# Altium project GameBoard_V1I1.PrjPcb (part 1 of 20)
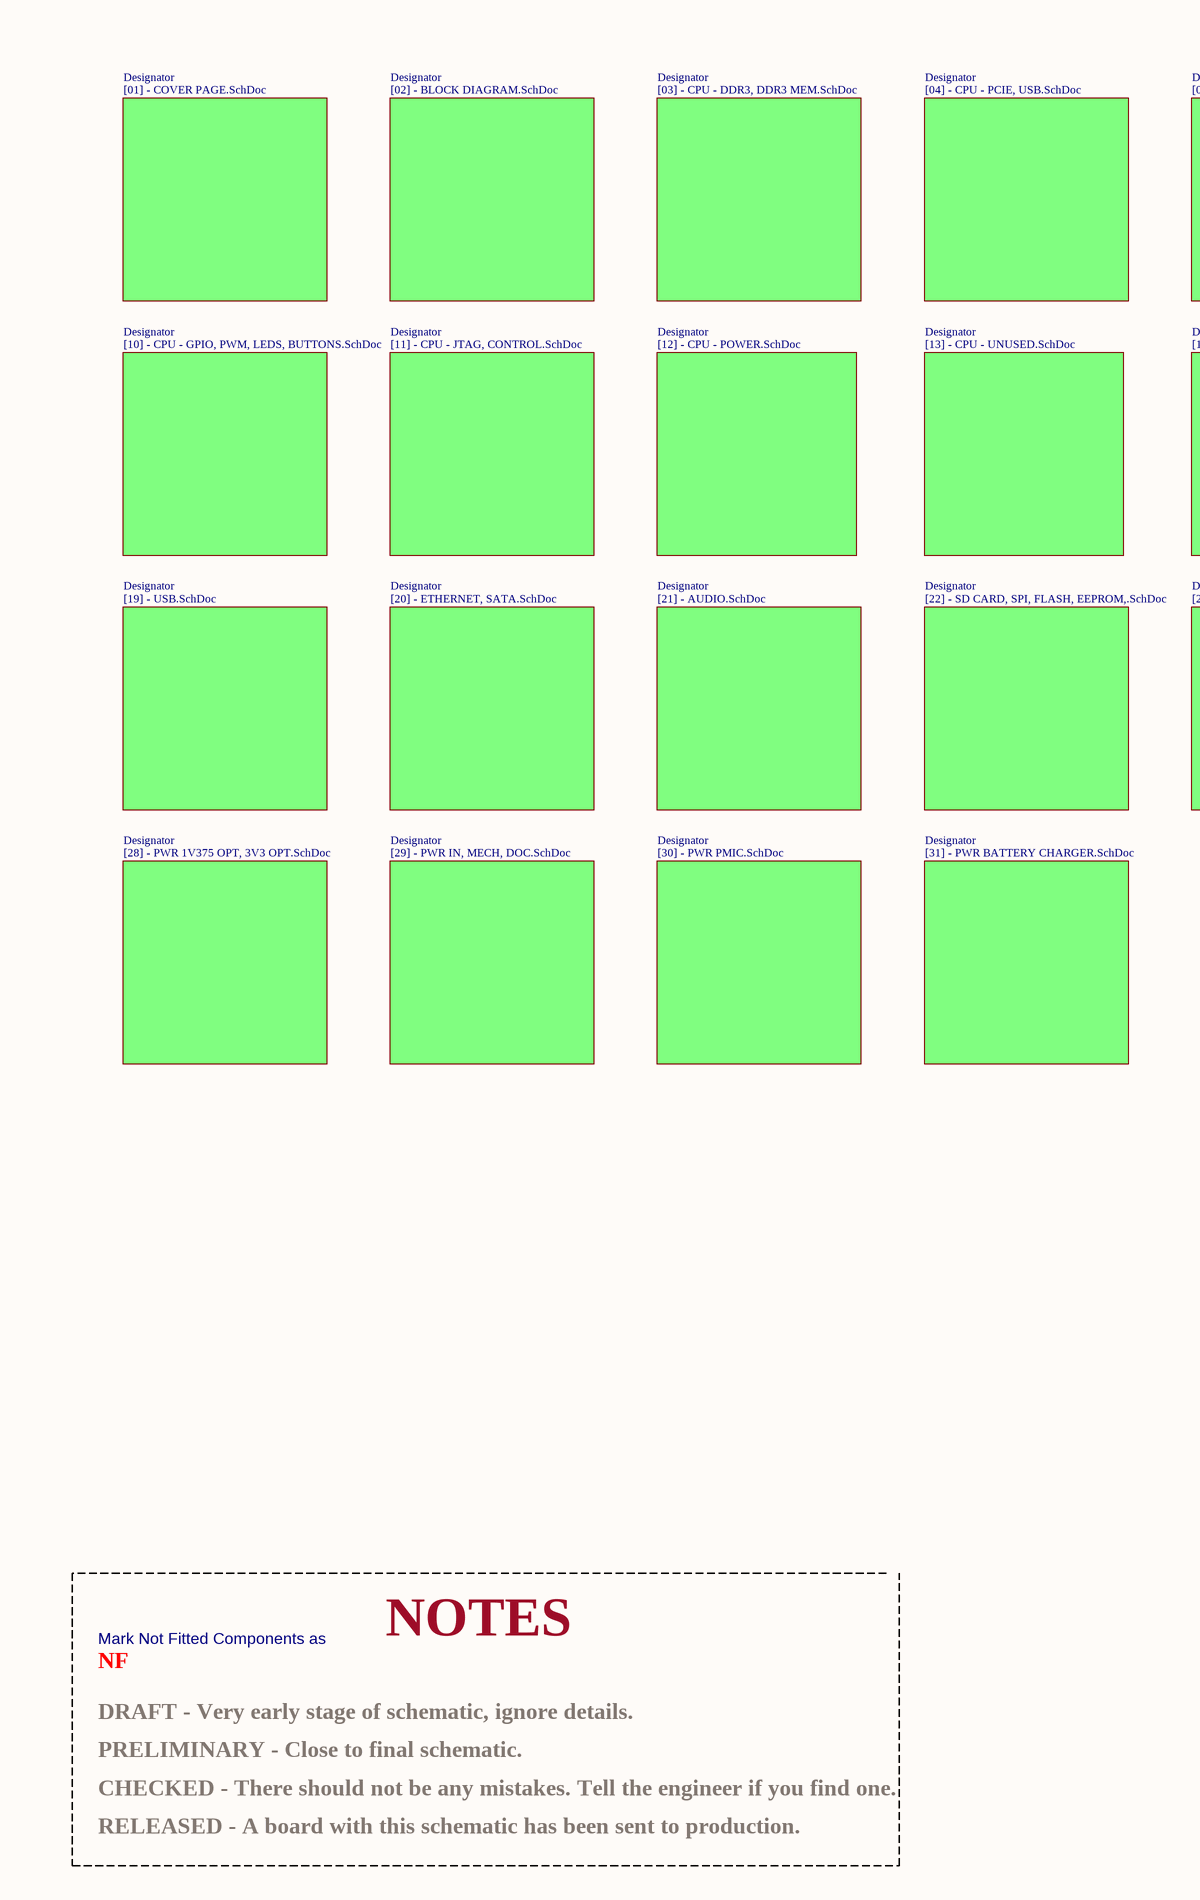
[diagram p0: GameBoard_V1I1 Project.SchDoc, left]
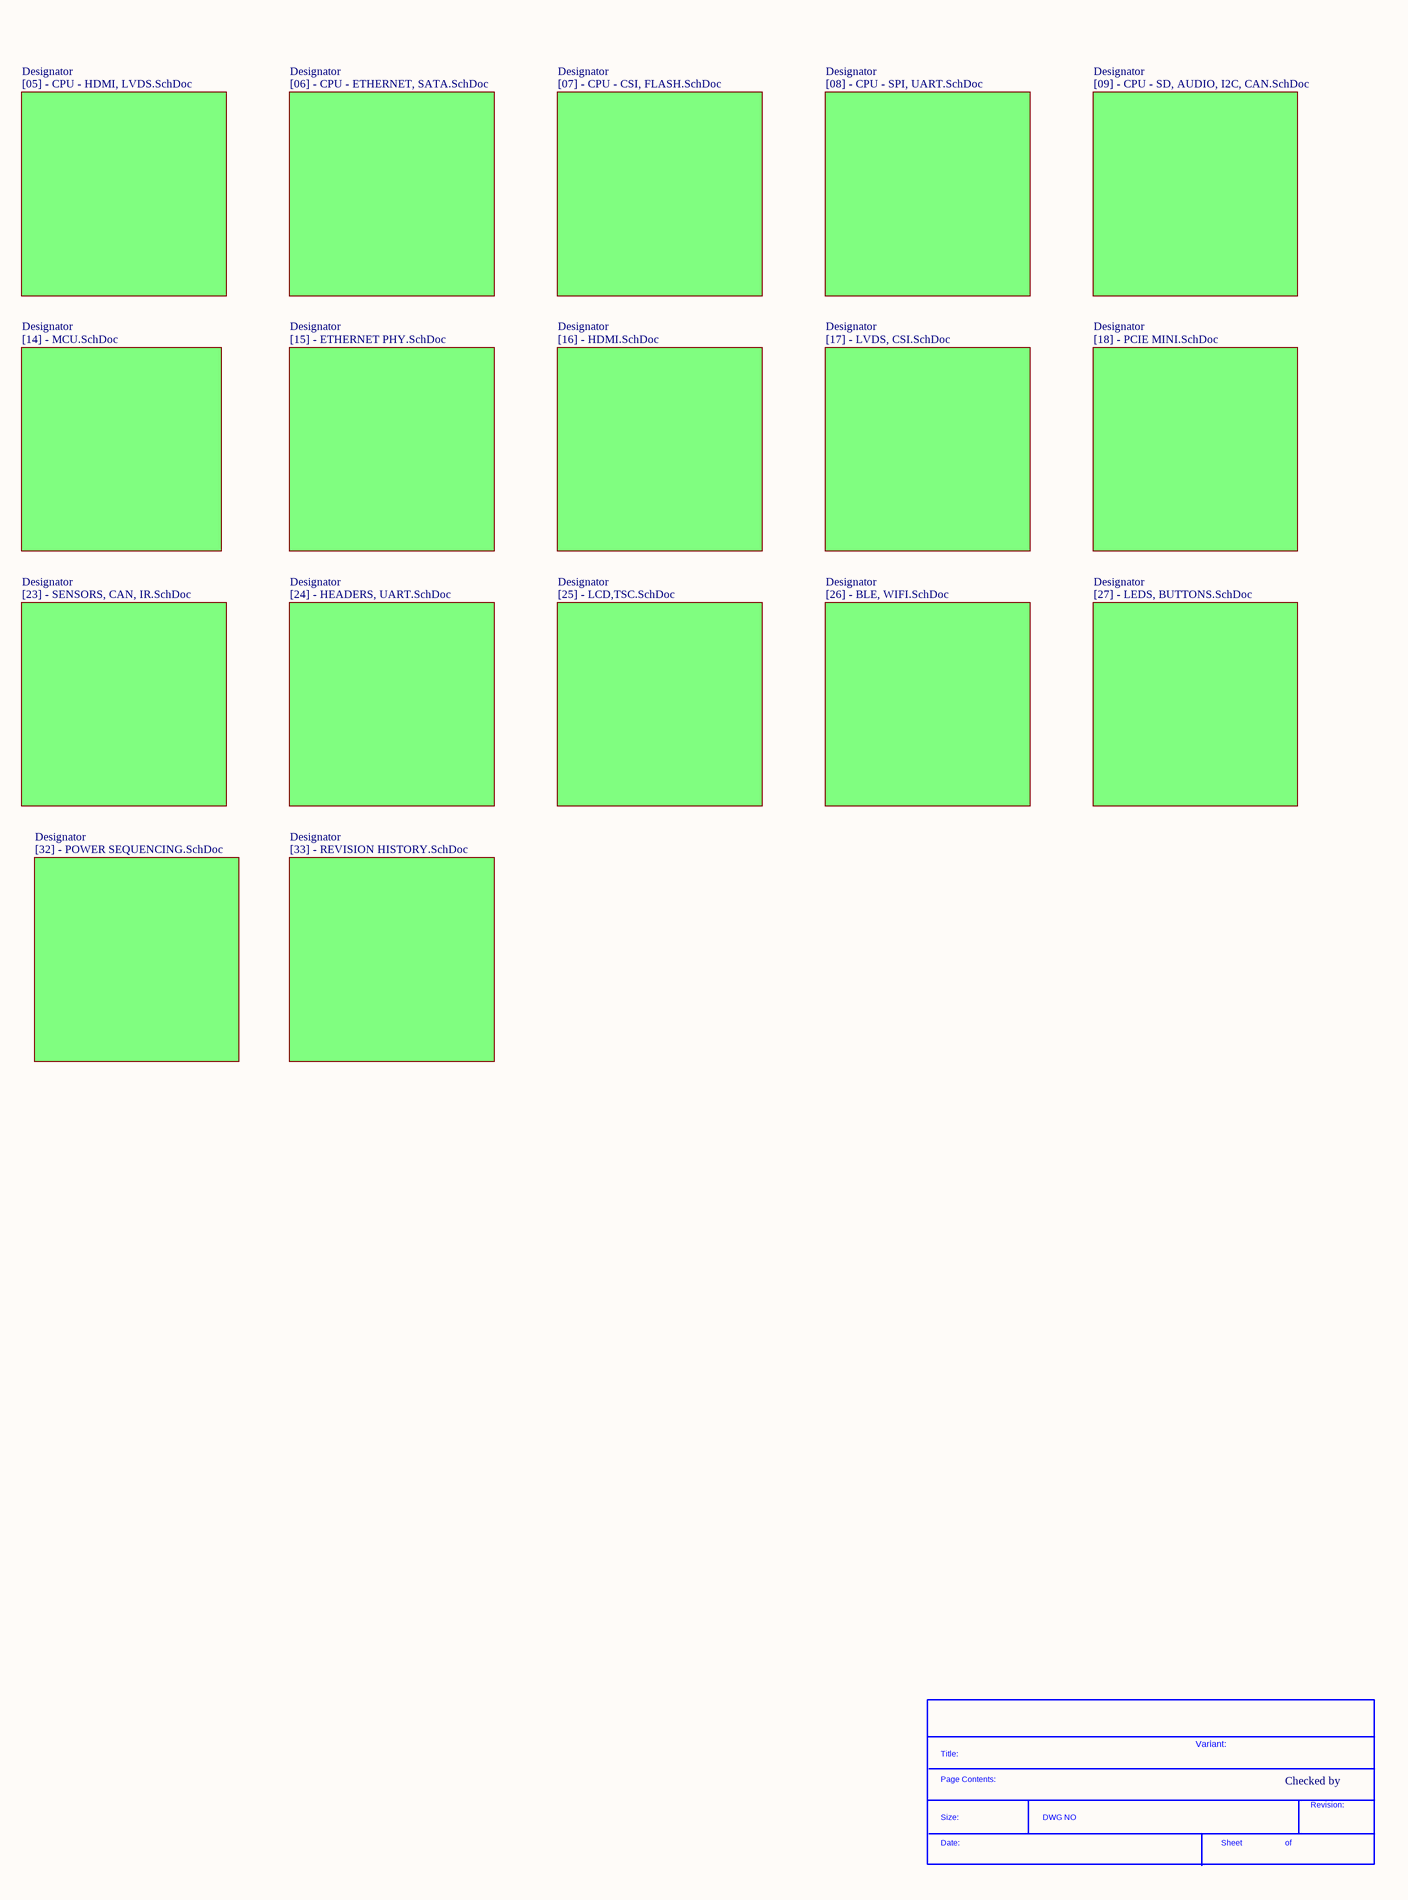
[diagram p1: GameBoard_V1I1 Project.SchDoc, right]
ClientCompanyName: BeachBoards; ClientContactEmail: beachm720@gmail.com; ClientContactName: Matthew Beach; Company: (c) 2018 BEACHBOARDS; NotFitted: NF; Project: GameBoard; VersionRevision: V1I1
34 sheets, 1592 parts. Net scope: flat (ports and power ports of the same name join across sheets).
Board file: GameBoard_V1I1.PcbDoc
Sheets:
  GameBoard_V1I1 Project.SchDoc
    Designator = [01] - COVER PAGE.SchDoc
    Designator = [02] - BLOCK DIAGRAM.SchDoc
    Designator = [17] - LVDS, CSI.SchDoc
    Designator = [04] - CPU - PCIE, USB.SchDoc
    Designator = [05] - CPU - HDMI, LVDS.SchDoc
    Designator = [06] - CPU - ETHERNET, SATA.SchDoc
    Designator = [08] - CPU - SPI, UART.SchDoc
    Designator = [10] - CPU - GPIO, PWM, LEDS, BUTTONS.SchDoc
    Designator = [09] - CPU - SD, AUDIO, I2C, CAN.SchDoc
    Designator = [03] - CPU - DDR3, DDR3 MEM.SchDoc
    Designator = [11] - CPU - JTAG, CONTROL.SchDoc
    Designator = [12] - CPU - POWER.SchDoc
    Designator = [18] - PCIE MINI.SchDoc
    Designator = [13] - CPU - UNUSED.SchDoc
    Designator = [15] - ETHERNET PHY.SchDoc
    Designator = [19] - USB.SchDoc
    Designator = [07] - CPU - CSI, FLASH.SchDoc
    Designator = [14] - MCU.SchDoc
    Designator = [20] - ETHERNET, SATA.SchDoc
    Designator = [27] - LEDS, BUTTONS.SchDoc
    Designator = [30] - PWR PMIC.SchDoc
    Designator = [29] - PWR IN, MECH, DOC.SchDoc
    Designator = [22] - SD CARD, SPI, FLASH, EEPROM,.SchDoc
    Designator = [23] - SENSORS, CAN, IR.SchDoc
    Designator = [16] - HDMI.SchDoc
    Designator = [21] - AUDIO.SchDoc
    Designator = [24] - HEADERS, UART.SchDoc
    Designator = [25] - LCD,TSC.SchDoc
    Designator = [31] - PWR BATTERY CHARGER.SchDoc
    Designator = [32] - POWER SEQUENCING.SchDoc
    Designator = [33] - REVISION HISTORY.SchDoc
    Designator = [28] - PWR 1V375 OPT, 3V3 OPT.SchDoc
    Designator = [26] - BLE, WIFI.SchDoc

## Sheet GameBoard_V1I1 Project.SchDoc
size C; DocumentNumber: 32; SheetNumber: 32; SheetTotal: 32; PageSetup: Record=PageOptions|CenterHorizontal=True|CenterVertical=True|PrintScale=1.07|XCorrection=1.00|YCorrection=1.00|PrintKind=1|BorderSize=5000000|LeftOffset=0|BottomOffset=0|Orientation=2|PaperLength=1000|PaperWidth=1000|Scale=100|PaperSource=7|PrintQuality=600|MediaType=1|DitherType=10|PaperKind=A3|PrintScaleMode=1

### Parts
(Parts that share a designator on the sheet are numbered #1, #2 ... from top to bottom, then left to right.)
*#1  SDTitleBlock  (value not drawn)  (graphical)

### Sub-sheets
Designator = [01] - COVER PAGE.SchDoc: no entries
Designator = [02] - BLOCK DIAGRAM.SchDoc: no entries
Designator = [17] - LVDS, CSI.SchDoc: no entries
Designator = [04] - CPU - PCIE, USB.SchDoc: no entries
Designator = [05] - CPU - HDMI, LVDS.SchDoc: no entries
Designator = [06] - CPU - ETHERNET, SATA.SchDoc: no entries
Designator = [08] - CPU - SPI, UART.SchDoc: no entries
Designator = [10] - CPU - GPIO, PWM, LEDS, BUTTONS.SchDoc: no entries
Designator = [09] - CPU - SD, AUDIO, I2C, CAN.SchDoc: no entries
Designator = [03] - CPU - DDR3, DDR3 MEM.SchDoc: no entries
Designator = [11] - CPU - JTAG, CONTROL.SchDoc: no entries
Designator = [12] - CPU - POWER.SchDoc: no entries
Designator = [18] - PCIE MINI.SchDoc: no entries
Designator = [13] - CPU - UNUSED.SchDoc: no entries
Designator = [15] - ETHERNET PHY.SchDoc: no entries
Designator = [19] - USB.SchDoc: no entries
Designator = [07] - CPU - CSI, FLASH.SchDoc: no entries
Designator = [14] - MCU.SchDoc: no entries
Designator = [20] - ETHERNET, SATA.SchDoc: no entries
Designator = [27] - LEDS, BUTTONS.SchDoc: no entries
Designator = [30] - PWR PMIC.SchDoc: no entries
Designator = [29] - PWR IN, MECH, DOC.SchDoc: no entries
Designator = [22] - SD CARD, SPI, FLASH, EEPROM,.SchDoc: no entries
Designator = [23] - SENSORS, CAN, IR.SchDoc: no entries
Designator = [16] - HDMI.SchDoc: no entries
Designator = [21] - AUDIO.SchDoc: no entries
Designator = [24] - HEADERS, UART.SchDoc: no entries
Designator = [25] - LCD,TSC.SchDoc: no entries
Designator = [31] - PWR BATTERY CHARGER.SchDoc: no entries
Designator = [32] - POWER SEQUENCING.SchDoc: no entries
Designator = [33] - REVISION HISTORY.SchDoc: no entries
Designator = [28] - PWR 1V375 OPT, 3V3 OPT.SchDoc: no entries
Designator = [26] - BLE, WIFI.SchDoc: no entries

### Notes on the sheet
- NF
- Mark Not Fitted Components as
- NOTES
- DRAFT - Very early stage of schematic, ignore details.
- PRELIMINARY - Close to final schematic.
- CHECKED - There should not be any mistakes. Tell the engineer if you find one.
- Variant:
- Checked by
- RELEASED - A board with this schematic has been sent to production.
- (in symbol SDTitleBlock) Title:; Page Contents:; Revision:; Size:; DWG NO; Date:; Sheet; of

## Sheet [01] - COVER PAGE.SchDoc
size A3; DocumentNumber: 1; SheetNumber: 1; SheetTotal: 32
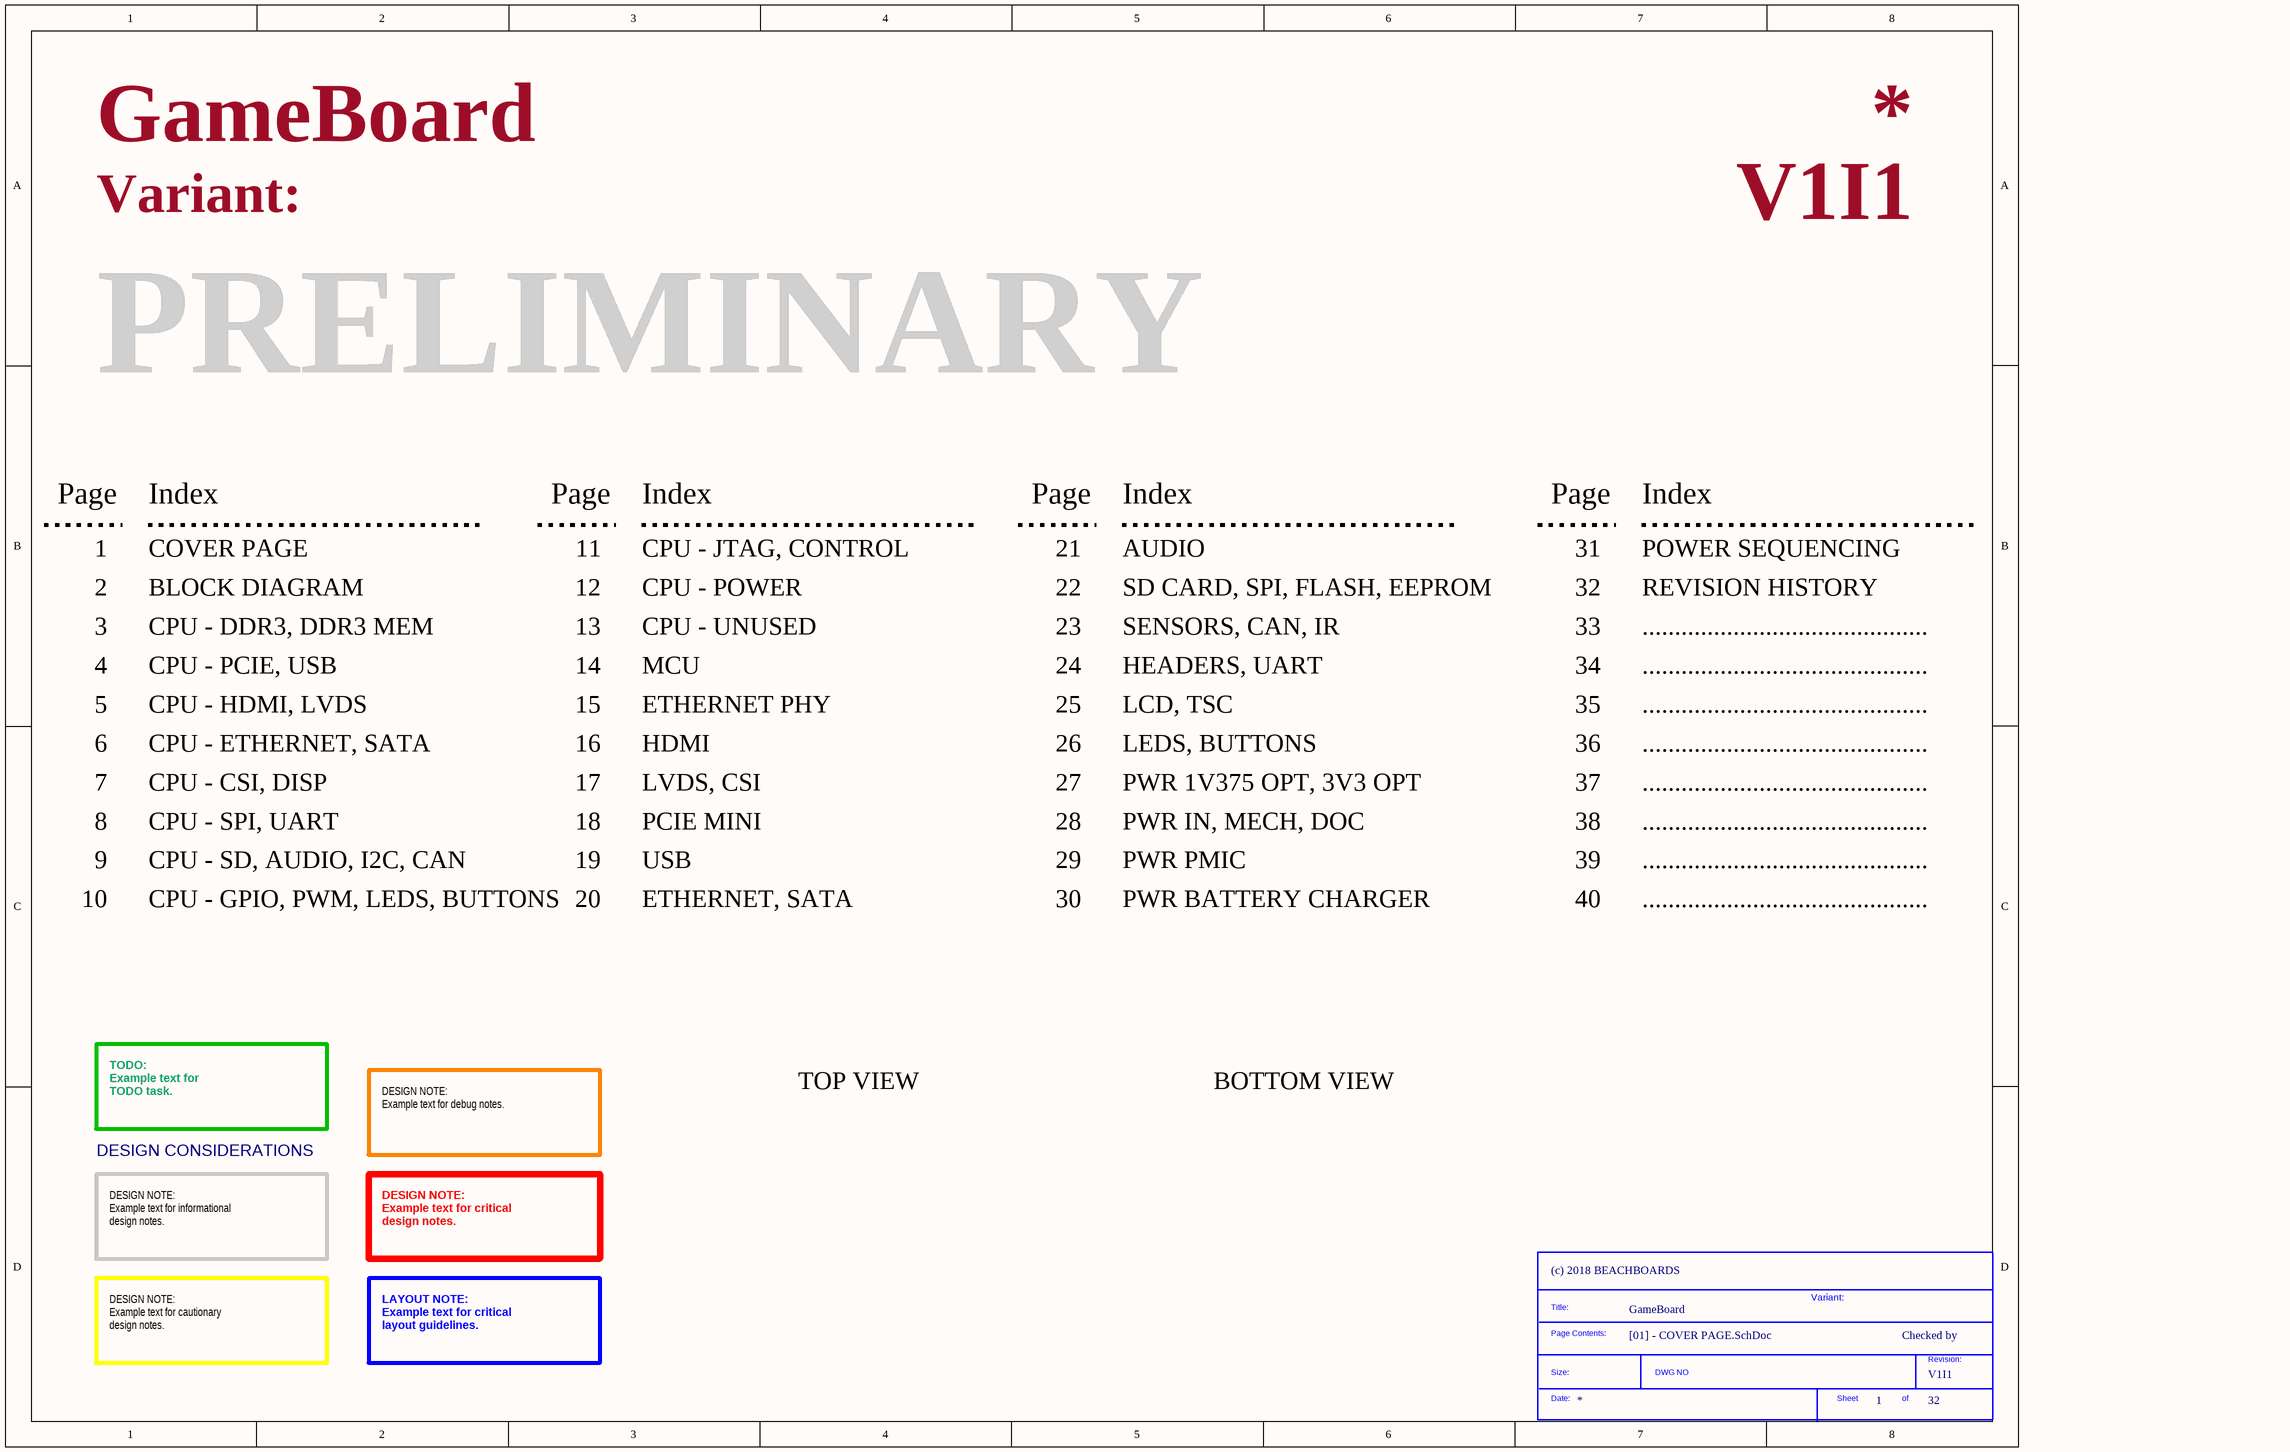
[diagram p2: [01] - COVER PAGE.SchDoc]

### Parts
(Parts that share a designator on the sheet are numbered #1, #2 ... from top to bottom, then left to right.)
*#2  SDTitleBlock  (value not drawn)  (graphical)

### Notes on the sheet
- Variant:
- PRELIMINARY
- Page
- 1
- Index
- COVER PAGE
- 11
- CPU - JTAG, CONTROL
- 21
- AUDIO
- 31
- POWER SEQUENCING
- 2
- BLOCK DIAGRAM
- 12
- CPU - POWER
- 22
- SD CARD, SPI, FLASH, EEPROM
- 32
- REVISION HISTORY
- 3
- 4
- CPU - DDR3, DDR3 MEM
- CPU - PCIE, USB
- 13
- 14
- CPU - UNUSED
- MCU
- 23
- 24
- SENSORS, CAN, IR
- HEADERS, UART
- 33
- 34
- ............................................
- 5
- 6
- CPU - HDMI, LVDS
- CPU - ETHERNET, SATA
- 15
- 16
- ETHERNET PHY
- HDMI
- 25
- 26
- LCD, TSC
- LEDS, BUTTONS
- 35
- 36
- 7
- CPU - CSI, DISP
- 17
- LVDS, CSI
- 27
- PWR 1V375 OPT, 3V3 OPT
- 37
- 8
- 9
- CPU - SPI, UART
- CPU - SD, AUDIO, I2C, CAN
- 18
- 19
- PCIE MINI
- USB
- 28
- 29
- PWR IN, MECH, DOC
- PWR PMIC
- 38
- 39
- 10
- CPU - GPIO, PWM, LEDS, BUTTONS
- 20
- ETHERNET, SATA
- 30
- PWR BATTERY CHARGER
- 40
- TODO:
  Example text for
  TODO task.
- DESIGN NOTE:
  Example text for debug notes.
- TOP VIEW
- BOTTOM VIEW
- DESIGN CONSIDERATIONS
- DESIGN NOTE:
  Example text for informational
  design notes.
- DESIGN NOTE:
  Example text for critical
  design notes.
- Checked by
- DESIGN NOTE:
  Example text for cautionary
  design notes.
- LAYOUT NOTE:
  Example text for critical
  layout guidelines.
- (in symbol SDTitleBlock) Title:; Page Contents:; Revision:; Size:; DWG NO; Date:; Sheet; of

## Sheet [02] - BLOCK DIAGRAM.SchDoc
size A2; DocumentNumber: 2; SheetNumber: 2; SheetTotal: 32; PageSetup: Record=PageOptions|CenterHorizontal=True|CenterVertical=True|PrintScale=0.52|XCorrection=1.00|YCorrection=1.00|PrintKind=1|BorderSize=5000000|LeftOffset=0|BottomOffset=0|Orientation=2|PaperLength=1000|PaperWidth=1000|Scale=100|PaperSource=4|PrintQuality=600|MediaType=1|DitherType=10|PrintScaleMode=1|PaperKind=A4|PaperIndex=9
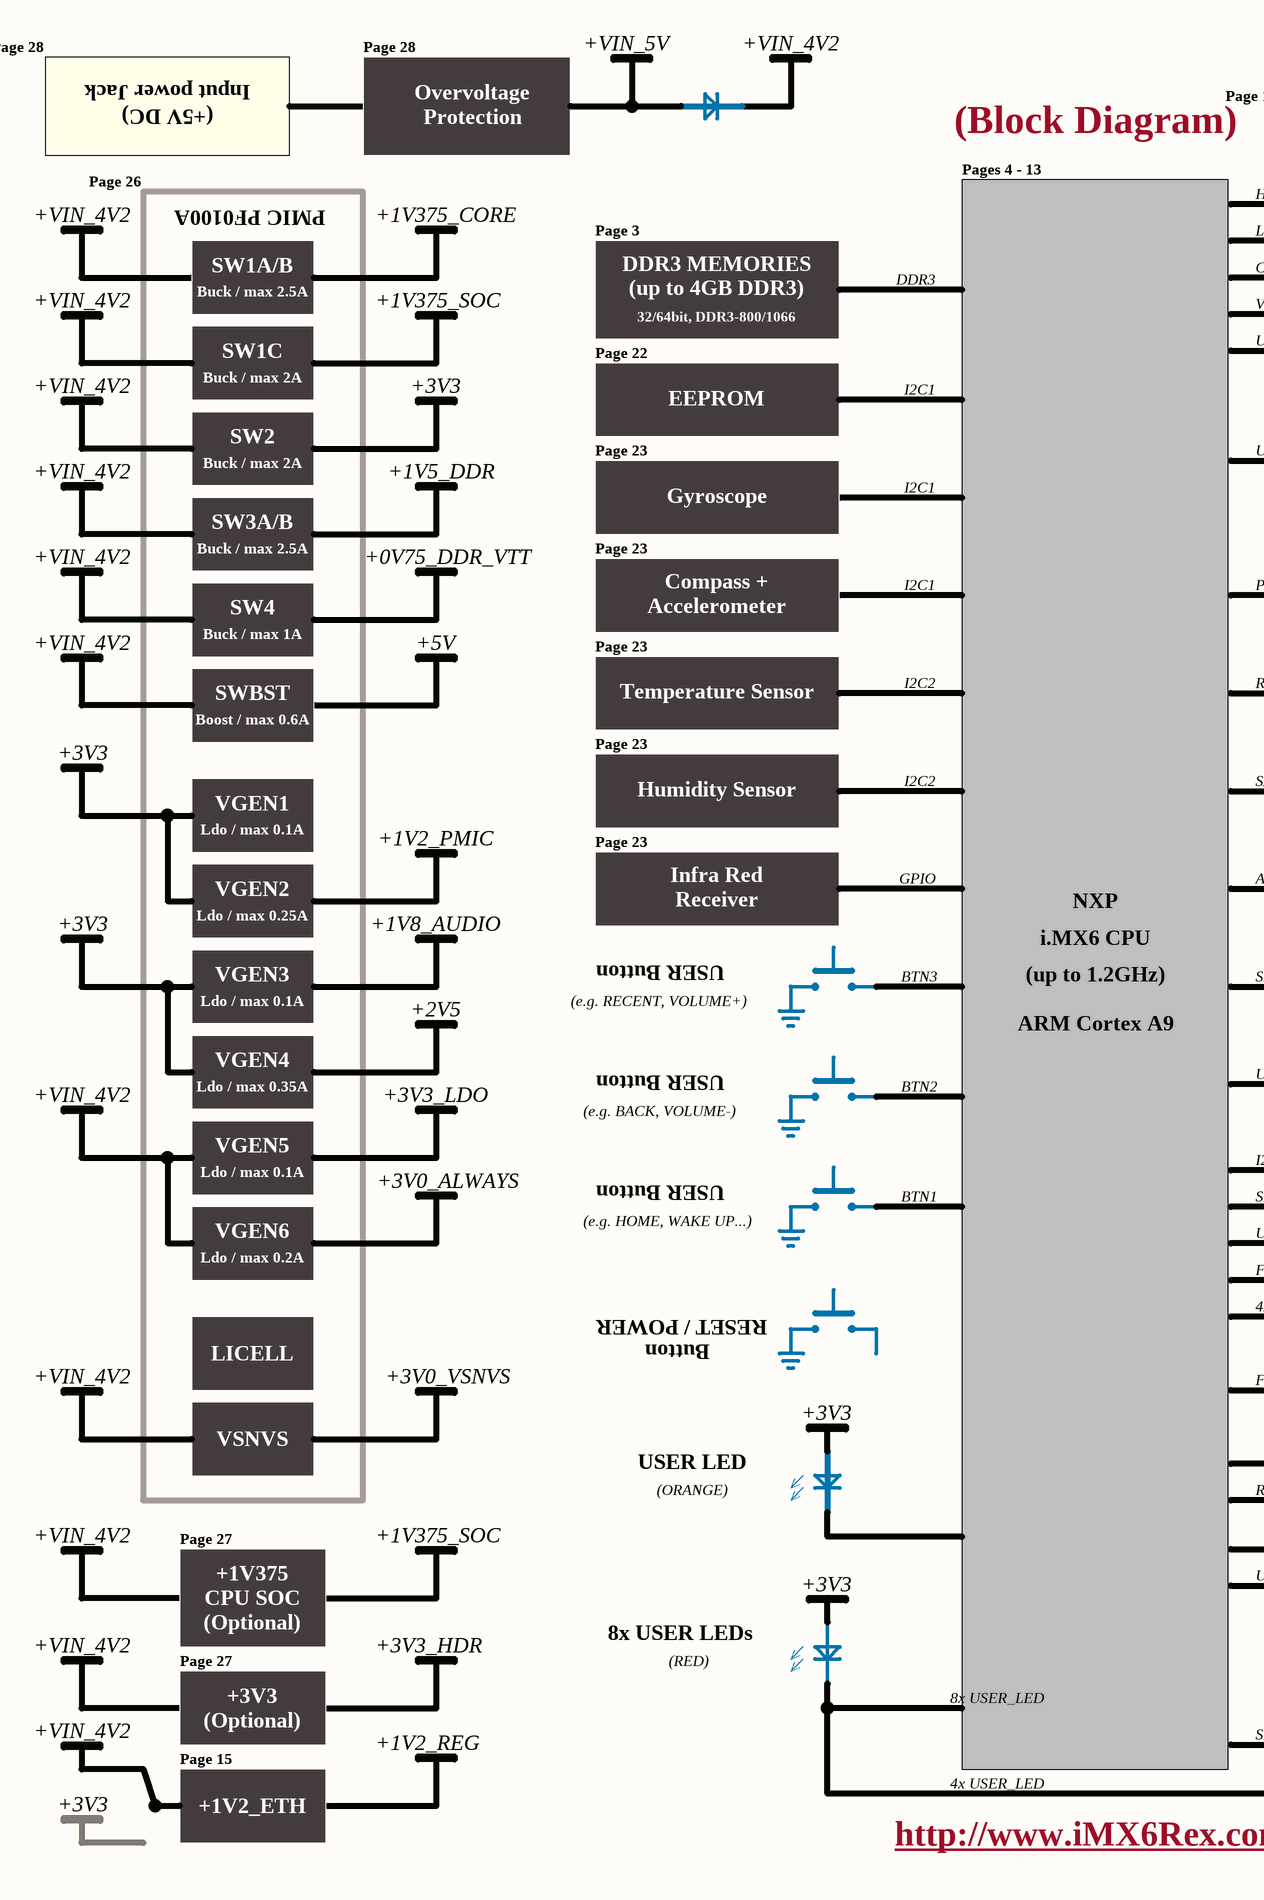
[diagram p3: [02] - BLOCK DIAGRAM.SchDoc, left]
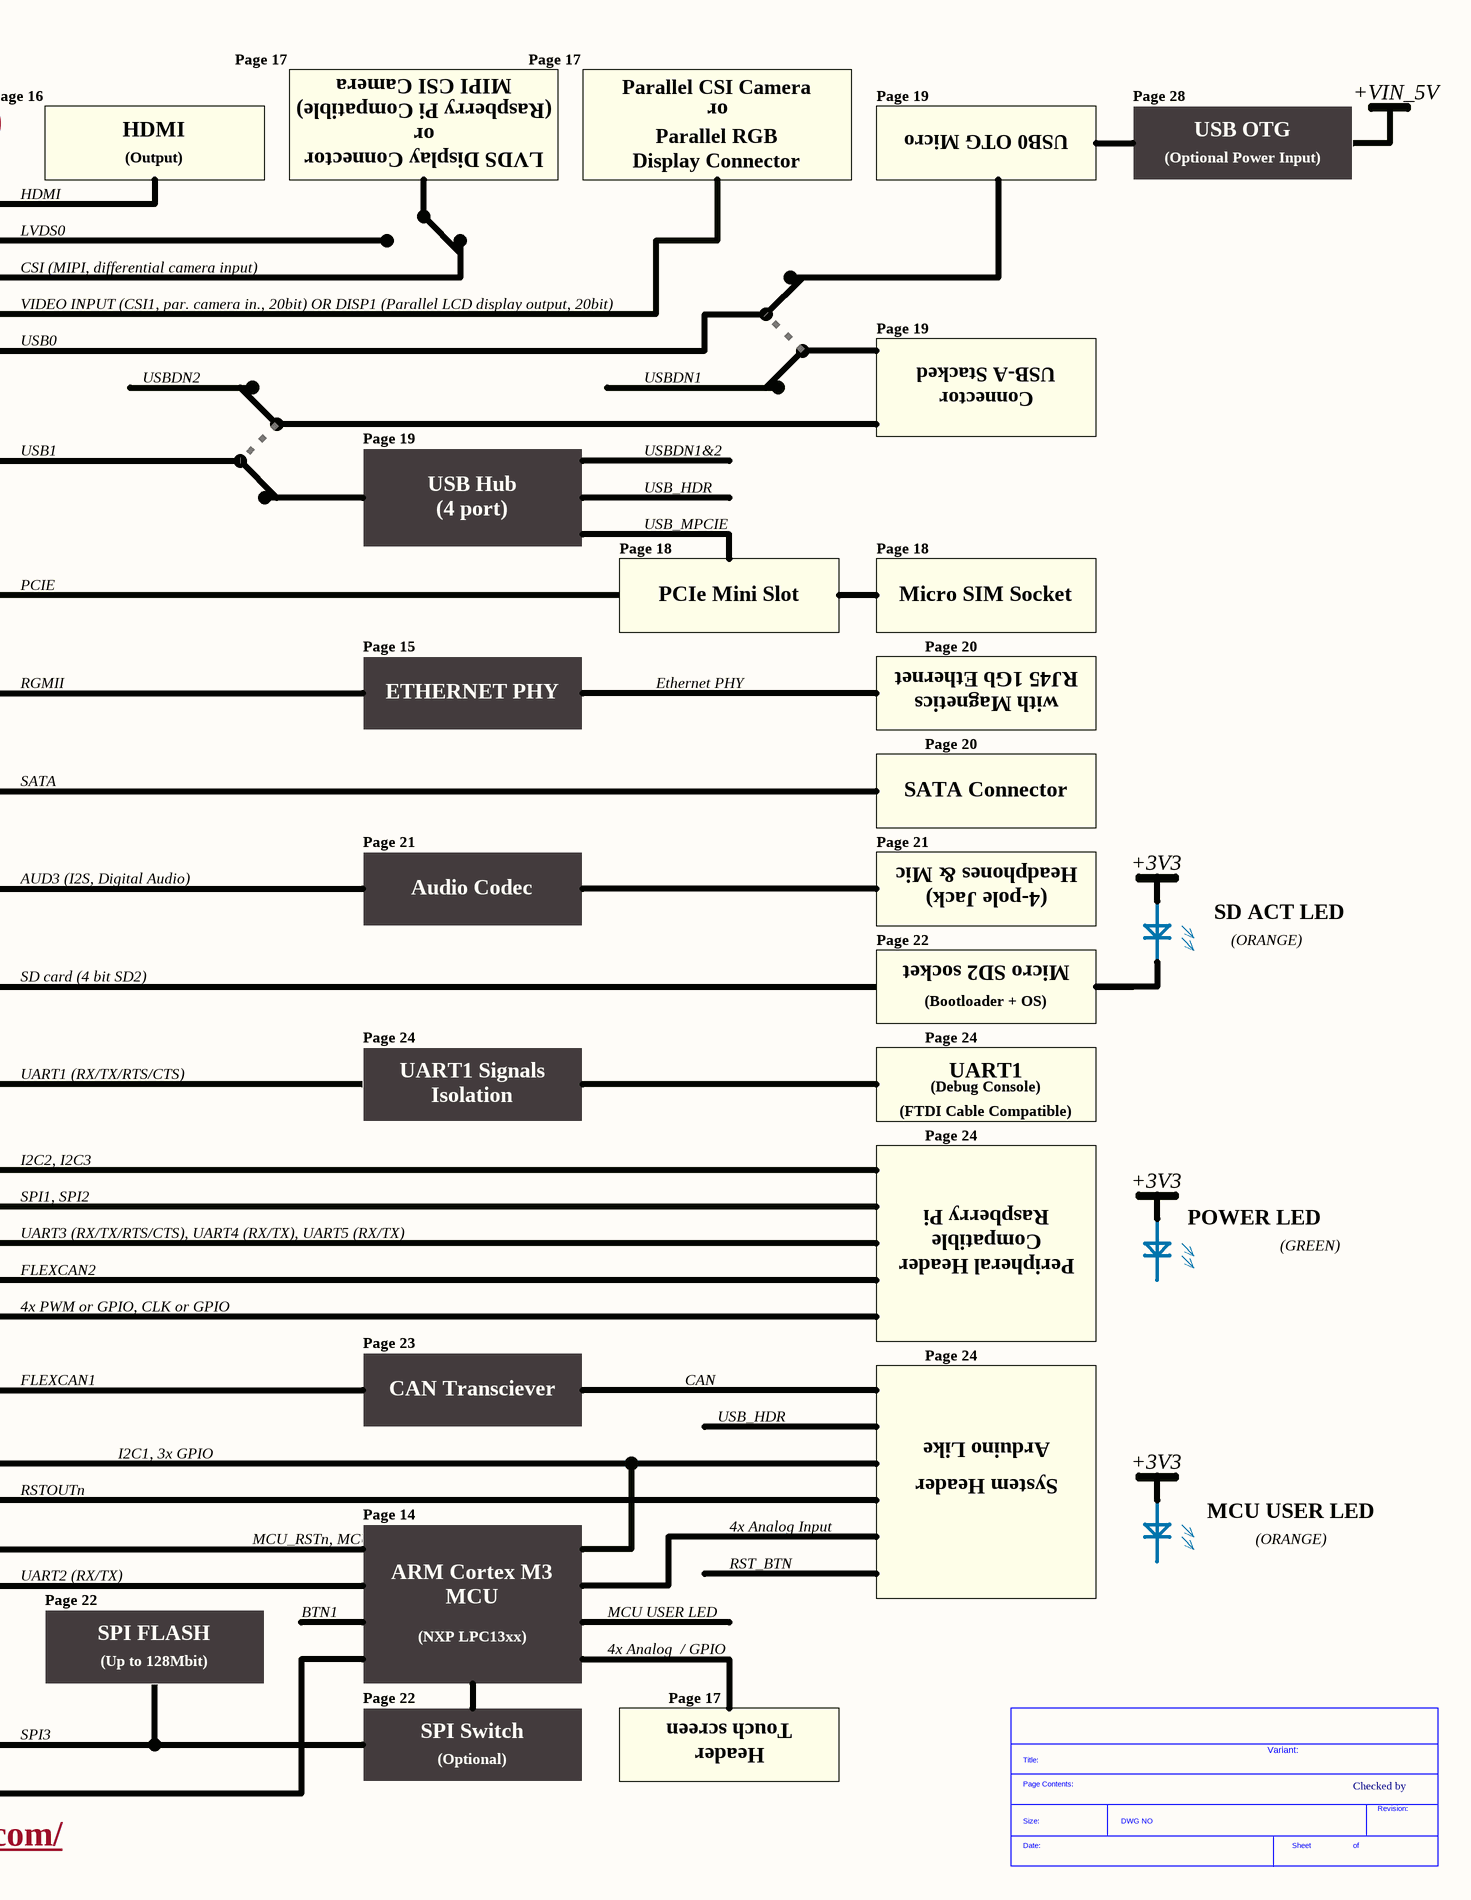
[diagram p4: [02] - BLOCK DIAGRAM.SchDoc, right]

### Parts
(Parts that share a designator on the sheet are numbered #1, #2 ... from top to bottom, then left to right.)
*#3  SDTitleBlock  (value not drawn)  (graphical)

### Notes on the sheet
- Page 28
- +VIN_5V
- +VIN_4V2
- Page 17
- MIPI CSI Camera
- Parallel CSI Camera
- Input power Jack
- (+5V DC)
- Overvoltage
- Protection
- (Block Diagram)
- Page 16
- HDMI
- (Raspberry Pi Compatible)
- or
- Parallel RGB
- Page 19
- USB0 OTG Micro
- USB OTG
- Page 26
- PMIC PF0100A
- Pages 4 - 13
- (Output)
- LVDS Display Connector
- Display Connector
- (Optional Power Input)
- SW1A/B
- +1V375_CORE
- Page 3
- DDR3 MEMORIES
- LVDS0
- CSI (MIPI, differential camera input)
- Buck / max 2.5A
- +1V375_SOC
- 32/64bit, DDR3-800/1066
- (up to 4GB DDR3)
- DDR3
- VIDEO INPUT (CSI1, par. camera in., 20bit) OR DISP1 (Parallel LCD display output, 20bit)
- SW1C
- Buck / max 2A
- +3V3
- Page 22
- I2C1
- USB0
- USBDN2
- USBDN1
- USB-A Stacked
- SW2
- Page 23
- EEPROM
- USB1
- USBDN1&2
- Connector
- SW3A/B
- +1V5_DDR
- Gyroscope
- USB Hub
- (4 port)
- USB_HDR
- +0V75_DDR_VTT
- Page 18
- USB_MPCIE
- SW4
- Buck / max 1A
- Compass +
- Accelerometer
- PCIE
- PCIe Mini Slot
- Micro SIM Socket
- SWBST
- +5V
- Temperature Sensor
- I2C2
- RGMII
- Page 15
- ETHERNET PHY
- Ethernet PHY
- Page 20
- RJ45 1Gb Ethernet
- Boost / max 0.6A
- with Magnetics
- VGEN1
- Humidity Sensor
- SATA
- SATA Connector
- Ldo / max 0.1A
- VGEN2
- +1V2_PMIC
- Infra Red
- GPIO
- AUD3 (I2S, Digital Audio)
- Page 21
- Headphones & Mic
- Ldo / max 0.25A
- +1V8_AUDIO
- Receiver
- NXP
- i.MX6 CPU
- Audio Codec
- (4-pole Jack)
- (ORANGE)
- SD ACT LED
- VGEN3
- (e.g. RECENT, VOLUME+)
- USER Button
- BTN3
- (up to 1.2GHz)
- SD card (4 bit SD2)
- Micro SD2 socket
- (Bootloader + OS)
- VGEN4
- +2V5
- ARM Cortex A9
- Page 24
- Ldo / max 0.35A
- +3V3_LDO
- (e.g. BACK, VOLUME-)
- BTN2
- UART1 (RX/TX/RTS/CTS)
- UART1 Signals
- Isolation
- UART1
- (Debug Console)
- (FTDI Cable Compatible)
- VGEN5
- +3V0_ALWAYS
- I2C2, I2C3
- VGEN6
- (e.g. HOME, WAKE UP...)
- BTN1
- SPI1, SPI2
- UART3 (RX/TX/RTS/CTS), UART4 (RX/TX), UART5 (RX/TX)
- Raspberry Pi
- Compatible
- POWER LED
- (GREEN)
- Ldo / max 0.2A
- 4x PWM or GPIO, CLK or GPIO
- FLEXCAN2
- Peripheral Header
- LICELL
- RESET / POWER
- Button
- VSNVS
- +3V0_VSNVS
- FLEXCAN1
- CAN Transciever
- CAN
- USER LED
- RSTOUTn
- I2C1, 3x GPIO
- System Header
- Arduino Like
- Page 27
- MCU_RSTn, MCU_ISPn, SWD debug
- Page 14
- 4x Analog Input
- MCU USER LED
- +1V375
- CPU SOC
- (Optional)
- UART2 (RX/TX)
- ARM Cortex M3
- MCU
- RST_BTN
- +3V3_HDR
- (RED)
- 8x USER LEDs
- SPI FLASH
- (Up to 128Mbit)
- (NXP LPC13xx)
- 4x Analog  / GPIO
- 8x USER_LED
- SPI3
- SPI Switch
- Touch screen
- +1V2_ETH
- +1V2_REG
- 4x USER_LED
- Header
- Variant:
- Checked by
- http://www.iMX6Rex.com/
- (in symbol SDTitleBlock) Title:; Page Contents:; Revision:; Size:; DWG NO; Date:; Sheet; of

## Sheet [17] - LVDS, CSI.SchDoc
size A2; DocumentNumber: 17; SheetNumber: 17; SheetTotal: 32
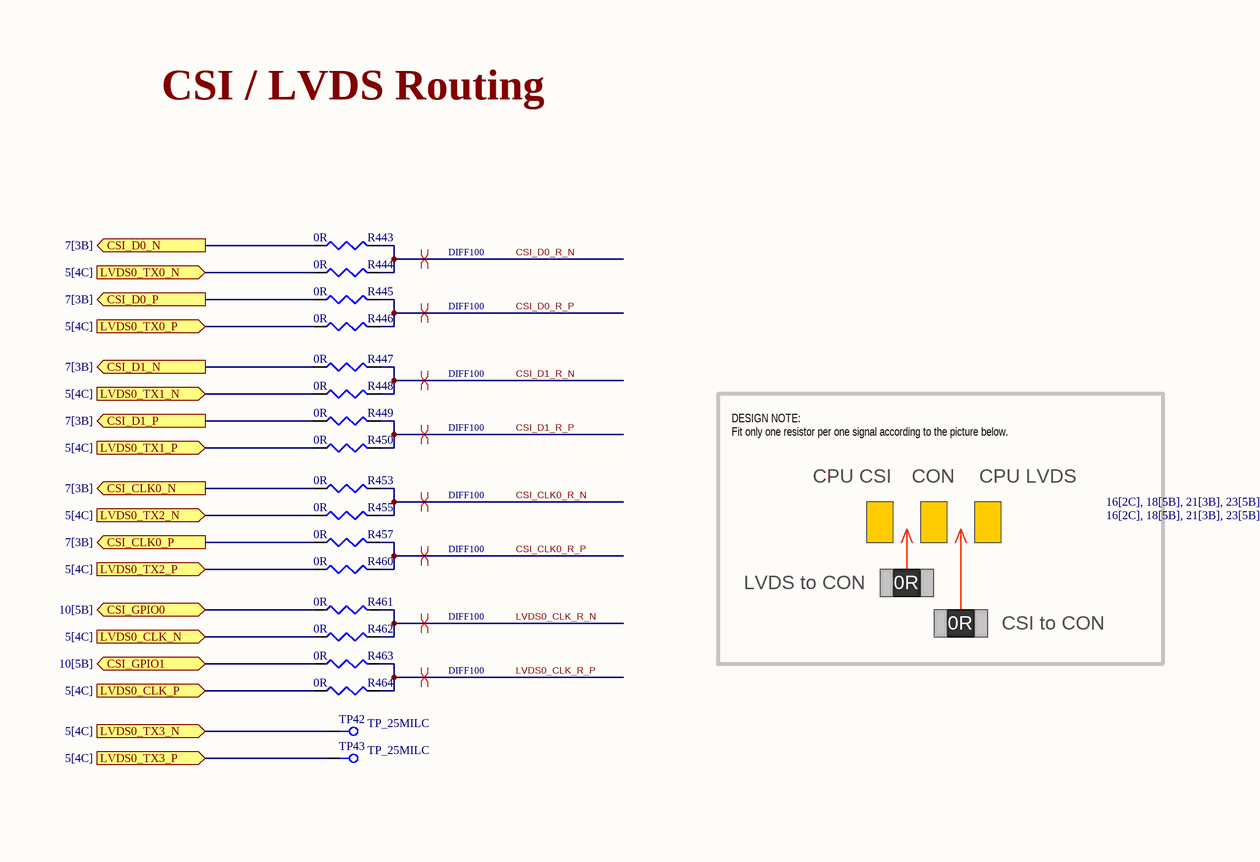
[diagram p5: [17] - LVDS, CSI.SchDoc, top left]
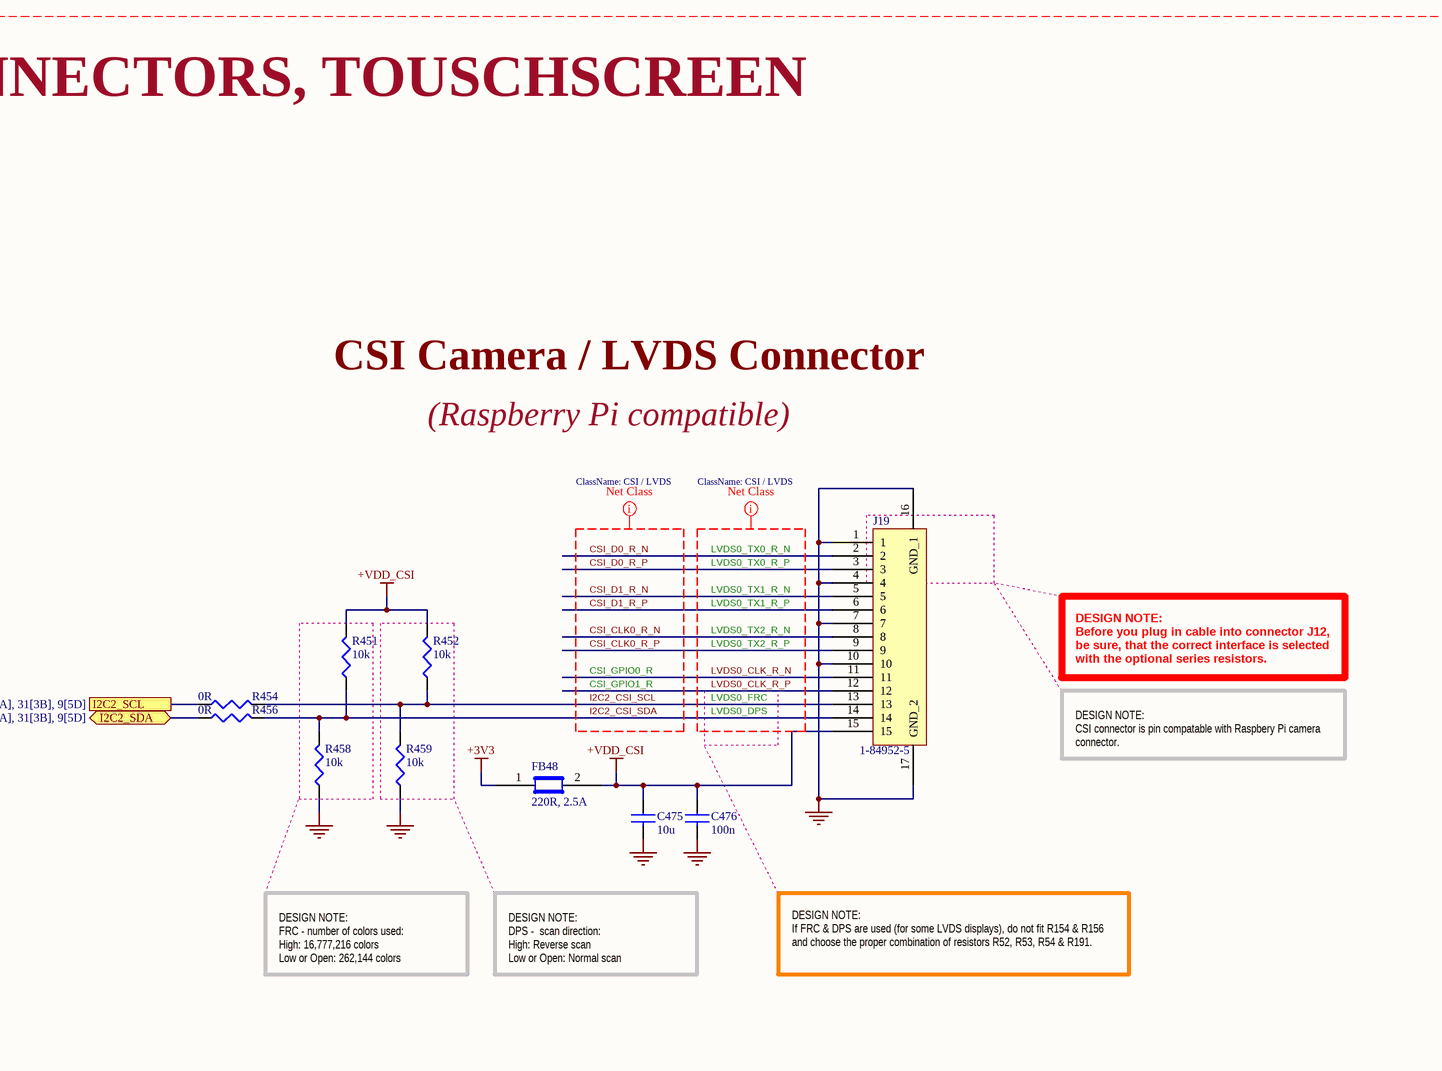
[diagram p6: [17] - LVDS, CSI.SchDoc, top right]
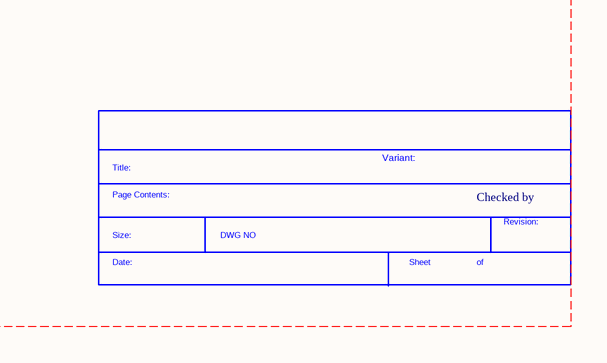
[diagram p7: [17] - LVDS, CSI.SchDoc, bottom right]

### Parts
(Parts that share a designator on the sheet are numbered #1, #2 ... from top to bottom, then left to right.)
*#4  SDTitleBlock  (value not drawn)  (graphical)
C475  10u  [C0603]
C476  100n  [C0402]
FB48  220R, 2.5A  [C0603]
J19  1-84952-5  [ZIF_RA_BOTTOM_15x1mm]
R443  0R  [R0402]
R444  0R  [R0402]
R445  0R  [R0402]
R446  0R  [R0402]
R447  0R  [R0402]
R448  0R  [R0402]
R449  0R  [R0402]
R450  0R  [R0402]
R451  10k  [R0402]
R452  10k  [R0402]
R453  0R  [R0402]
R454  0R  [R0402]
R455  0R  [R0402]
R456  0R  [R0402]
R457  0R  [R0402]
R458  10k  [R0402]
R459  10k  [R0402]
R460  0R  [R0402]
R461  0R  [R0402]
R462  0R  [R0402]
R463  0R  [R0402]
R464  0R  [R0402]
TP42  TP_25MILC  [TP_25C]  (no BOM)
TP43  TP_25MILC  [TP_25C]  (no BOM)

### Ports
CSI_CLK0_N (out, see 7[3B]), CSI_CLK0_P (out, see 7[3B]), CSI_D0_N (out, see 7[3B]), CSI_D0_P (out, see 7[3B]), CSI_D1_N (out, see 7[3B]), CSI_D1_P (out, see 7[3B]), CSI_GPIO0 (bidir, see 10[5B]), CSI_GPIO1 (bidir, see 10[5B]), I2C2_SCL (see 16[2C], 18[5B], 21[3B], 23[5B], 24[2A], 31[3B], 9[5D]), I2C2_SDA (bidir, see 16[2C], 18[5B], 21[3B], 23[5B], 24[2A], 31[3B], 9[5D]), LVDS0_CLK_N (in, see 5[4C]), LVDS0_CLK_P (in, see 5[4C]), LVDS0_TX0_N (in, see 5[4C]), LVDS0_TX0_P (in, see 5[4C]), LVDS0_TX1_N (in, see 5[4C]), LVDS0_TX1_P (in, see 5[4C]), LVDS0_TX2_N (in, see 5[4C]), LVDS0_TX2_P (in, see 5[4C]), LVDS0_TX3_N (in, see 5[4C]), LVDS0_TX3_P (in, see 5[4C])

### Nets
+3V3: FB48.1
+VDD_CSI: C475.1 C476.1 FB48.2 J19.15 R451.2 R452.2
GND: C475.2 C476.2 J19.1 J19.4 J19.7 J19.10 J19.16(GND_1) J19.17(GND_2) R458.1 R459.1
CSI_CLK0_N: R453.1 ; port CSI_CLK0_N
CSI_CLK0_P: R457.1 ; port CSI_CLK0_P
CSI_CLK0_R_N: J19.8 R453.2 R455.2
CSI_CLK0_R_P: J19.9 R457.2 R460.2
CSI_D0_N: R443.1 ; port CSI_D0_N
CSI_D0_P: R445.1 ; port CSI_D0_P
CSI_D0_R_N: J19.2 R443.2 R444.2
CSI_D0_R_P: J19.3 R445.2 R446.2
CSI_D1_N: R447.1 ; port CSI_D1_N
CSI_D1_P: R449.1 ; port CSI_D1_P
CSI_D1_R_N: J19.5 R447.2 R448.2
CSI_D1_R_P: J19.6 R449.2 R450.2
CSI_GPIO0: R461.1 ; port CSI_GPIO0
CSI_GPIO1: R463.1 ; port CSI_GPIO1
I2C2_CSI_SCL: J19.13 R452.1 R454.2 R459.2
I2C2_CSI_SDA: J19.14 R451.1 R456.2 R458.2
I2C2_SCL: R454.1 ; port I2C2_SCL
I2C2_SDA: R456.1 ; port I2C2_SDA
LVDS0_CLK_N: R462.1 ; port LVDS0_CLK_N
LVDS0_CLK_P: R464.1 ; port LVDS0_CLK_P
LVDS0_CLK_R_N: J19.11 R461.2 R462.2
LVDS0_CLK_R_P: J19.12 R463.2 R464.2
LVDS0_TX0_N: R444.1 ; port LVDS0_TX0_N
LVDS0_TX0_P: R446.1 ; port LVDS0_TX0_P
LVDS0_TX1_N: R448.1 ; port LVDS0_TX1_N
LVDS0_TX1_P: R450.1 ; port LVDS0_TX1_P
LVDS0_TX2_N: R455.1 ; port LVDS0_TX2_N
LVDS0_TX2_P: R460.1 ; port LVDS0_TX2_P
LVDS0_TX3_N: TP42.1 ; port LVDS0_TX3_N
LVDS0_TX3_P: TP43.1 ; port LVDS0_TX3_P

### Layout directives
differential pair; net class DIFF100: CSI_CLK0_R_N, CSI_CLK0_R_P, CSI_D0_R_N, CSI_D0_R_P, CSI_D1_R_N, CSI_D1_R_P, LVDS0_CLK_R_N, LVDS0_CLK_R_P
net class CSI / LVDS: CSI_CLK0_R_N, CSI_CLK0_R_P, CSI_D0_R_N, CSI_D0_R_P, CSI_D1_R_N, CSI_D1_R_P, I2C2_CSI_SCL, I2C2_CSI_SDA, LVDS0_CLK_R_N, LVDS0_CLK_R_P
net class [17] - LVDS/CSI: +3V3, +VDD_CSI, CSI_CLK0_R_N, CSI_CLK0_R_P, CSI_D0_R_N, CSI_D0_R_P, CSI_D1_R_N, CSI_D1_R_P, GND, I2C2_CSI_SCL, I2C2_CSI_SDA, LVDS0_CLK_R_N, LVDS0_CLK_R_P

### Notes on the sheet
- LVDS / CSI, LCD / CSI1 CONNECTORS, TOUSCHSCREEN
- CSI / LVDS Routing
- (Raspberry Pi compatible)
- CSI Camera / LVDS Connector
- LVDS0_TX0_R_P
- LVDS0_TX0_R_N
- LVDS0_TX2_R_N
- LVDS0_TX1_R_N
- LVDS0_TX1_R_P
- DESIGN NOTE:
  Fit only one resistor per one signal according to the picture below.
- CPU CSI
- CON
- CPU LVDS
- CSI_GPIO1_R
- CSI_GPIO0_R
- LVDS0_TX2_R_P
- LVDS0_FRC
- DESIGN NOTE:
  Before you plug in cable into connector J12, be sure, that the correct interface is selected with the optional series resistors.
- LVDS0_DPS
- DESIGN NOTE:
  CSI connector is pin compatable with Raspbery Pi camera connector.
- LVDS to CON
- 0R
- CSI to CON
- DESIGN NOTE:
  FRC - number of colors used:
  High: 16,777,216 colors
  Low or Open: 262,144 colors
- DESIGN NOTE:
  DPS -  scan direction:
  High: Reverse scan
  Low or Open: Normal scan
- DESIGN NOTE:
  If FRC & DPS are used (for some LVDS displays), do not fit R154 & R156 and choose the proper combination of resistors R52, R53, R54 & R191.
- Variant:
- Checked by
- (in symbol SDTitleBlock) Title:; Page Contents:; Revision:; Size:; DWG NO; Date:; Sheet; of

### Library data of the parts
C475 = C1608X5R0J106M: CAP CER 10UF 6.3V X5R 20% 0603; Manufacturer: TDK Corporation; Capacitance: 10µF; Value: 10µF; .Checked PCB: used; Category: Capacitors; Supplier Part Number: 445-4112-1-ND; Manufacturer Part Number: C1608X5R0J106M; Operating Temperature: -55°C ~ 85°C; Package / Case: 0603 (1608 Metric); Price 1k [$]: 0.08580; .Checked SCH: used; Voltage - Rated: 6.3V; Features: Low ESR; Supplier: Digikey; Supplier 1: Digi-Key; Supplier Part Number 1: 445-4112-1-ND; RoHS: RoHS Compliant; Stock 1: 48157; Pricing 1: 1=0.46, 10=0.363, 100=0.1898, 250=0.14024, 500=0.1089, 1000=0.0858 (USD); Tolerance: ±20%; Temperature Coefficient: X5R; Mounting Type: Surface Mount, MLCC; Applications: General Purpose; Ratings: -; Size / Dimension: 0.063" L x 0.031" W (1.60mm x 0.80mm); Height - Seated (Max): -; Thickness (Max): 0.037" (0.95mm); Lead Spacing: -; Packaging: Cut Tape (CT); Lead Style: -; ComponentLink1URL: http://www.tdk.com/pdf/general_B11.pdf; ComponentLink1Description: http://www.tdk.com/pdf/general_B11.pdf
C476 = C1005X5R1H104K: CAP CER .10UF 50V X5R 10% 0402; Manufacturer: TDK Corporation; Capacitance: 0.1µF; Value: 100nF; .Checked PCB: used; Category: Capacitors; Supplier Part Number: 445-5942-1-ND; Manufacturer Part Number: C1005X5R1H104K; Operating Temperature: -55°C ~ 85°C; Package / Case: 0402 (1005 Metric); Price 1k [$]: 0.02340; .Checked SCH: used; Voltage - Rated: 50V; Supplier: Digikey; Supplier 1: Digi-Key; Supplier Part Number 1: 445-5942-1-ND; RoHS: RoHS Compliant; Stock 1: 106926; Pricing 1: 1=0.27, 10=0.18, 100=0.072, 250=0.05176, 500=0.0369, 1000=0.027 (USD); Tolerance: ±10%; Temperature Coefficient: X5R; Mounting Type: Surface Mount, MLCC; Applications: General Purpose; Ratings: -; Size / Dimension: 0.039" L x 0.020" W (1.00mm x 0.50mm); Height - Seated (Max): -; Thickness (Max): 0.022" (0.55mm); Lead Spacing: -; Features: -; Packaging: Cut Tape (CT); Lead Style: -; ComponentLink1URL: http://www.tdk.co.jp/tefe02/e412_c.pdf; ComponentLink1Description: http://www.tdk.co.jp/tefe02/e412_c.pdf; Supplier 2: Digi-Key; Supplier Part Number 2: 311-1697-6-ND
FB48 = BLM18SG221TN1D: FERRITE CHIP 220 OHM 2500MA 0603; Manufacturer: Murata Electronics North America; Impedance @ Frequency: 220 Ohm @ 100MHz; DC Resistance (DCR): 40 mOhm Max; Filter Type: Differential Mode - Single; Number of Lines: 1; .Checked PCB: used; Supplier 1: Digi-Key; Supplier Part Number 1: 490-5225-1-ND; Manufacturer Part Number: BLM18SG221TN1D; RoHS: RoHS Compliant; Category: Filters; Stock 1: 54640; Pricing 1: 1=0.38, 10=0.282, 50=0.1646, 100=0.1316, 250=0.094, 500=0.06392, 1000=0.0517, 5000=0.04042 (USD); Current Rating: 2.5A; Package / Case: 0603 (1608 Metric); Mounting Type: Surface Mount; Packaging: Cut Tape (CT); Height (Max): 0.037" (0.95mm); Size / Dimension: 0.063" L x 0.031" W (1.60mm x 0.80mm); ComponentLink1URL: http://search.murata.co.jp/Ceramy/image/img/PDF/ENG/L0110S0100BLM18S.pdf; ComponentLink1Description: http://search.murata.co.jp/Ceramy/image/img/PDF/ENG/L0110S0100BLM18S.pdf; .Checked SCH: used
J19 = 1-84952-5: CONN FPC BOTTOM 15POS 1.00MM R/A; Manufacturer: TE Connectivity; Connector/Contact Type: Contacts, Bottom; Number of Positions: 15; Pitch: 0.039" (1.00mm); FFC, FCB Thickness: 0.30mm; Locking Feature: Slide Lock; Cable End Type: Straight; Actuator Material: Polyamide (PA), Nylon, Glass Filled; Voltage Rating: 200V; Material Flammability Rating: UL94 V-0; Current Rating: 1A; .Creator: MM; .Checked PCB: used; Supplier 1: Digi-Key; Manufacturer Part Number: 1-84952-5; RoHS: RoHS Compliant; Category: Connectors, Interconnects; Stock 1: 3321; Pricing 1: 1=2.32, 10=2.107, 25=1.9776, 50=1.8918, 100=1.8057, 250=1.63376, 500=1.50478 (USD); Packaging: Cut Tape (CT); Flat Flex Type: FPC; Mounting Type: Surface Mount, Right Angle; Termination: Solder; Height Above Board: 0.101" (2.56mm); Contact Material: Phosphor Bronze; Contact Finish: Tin; Housing Material: Liquid Crystal Polymer (LCP), Glass Filled; Features: Solder Retention, Zero Insertion Force (ZIF); Operating Temperature: -40°C ~ 85°C; ComponentLink1URL: http://www.te.com/commerce/DocumentDelivery/DDEController?Action=srchrtrv&DocNm=84952&DocType=Customer+Drawing&DocLang=English; ComponentLink1Description: http://www.te.com/commerce/DocumentDelivery/DDEController?Action=srchrtrv&DocNm=84952&DocType=Customer+Drawing&DocLang=English; Supplier Part Number 1: A101391CT-ND; .Checked SCH: used
R443-R450 R453-R457 R460-R464 = RC0402JR-070RL: RES 0.0 OHM 1/16W 0402 SMD; Manufacturer: Yageo; Resistance (Ohms): 0.0; Power (Watts): 0.063W, 1/16W; Tolerance: Jumper; .Checked PCB: used; Category: Resistors; Manufacturer Part Number: RC0402JR-070RL; Package / Case: 0402 (1005 Metric); Price 1k [$]: 0.01389; Value: 0R; .Checked SCH: used; Supplier Part Number: 311-0.0JRCT-ND; Supplier: Digikey; Supplier 1: Digi-Key; Supplier Part Number 1: 311-0.0JRCT-ND; RoHS: RoHS Compliant; Stock 1: 1106330; Pricing 1: 10=0.012, 50=0.009, 100=0.0069, 250=0.00512, 500=0.0038, 1000=0.00253 (USD); Composition: Thick Film; Features: -; Temperature Coefficient: -; Size / Dimension: 0.039" L x 0.020" W (1.00mm x 0.50mm); Height: 0.016" (0.40mm); Number of Terminations: 2; Packaging: Cut Tape (CT); ComponentLink1URL: http://www.yageo.com/documents/recent/PYu-RC0402_51_RoHS_L_6.pdf; ComponentLink1Description: http://www.yageo.com/documents/recent/PYu-RC0402_51_RoHS_L_6.pdf
R451 R452 R458 R459 = RC0402FR-0710KL: RES 10.0K OHM 1/16W 1% 0402 SMD; Manufacturer: Yageo; Power (Watts): 0.063W, 1/16W; .Checked PCB: used; Temperature Coefficient: ±100ppm/°C; Category: Resistors; Supplier Part Number: 311-10.0KLRCT-ND; Manufacturer Part Number: RC0402FR-0710KL; Package / Case: 0402 (1005 Metric); Price 1k [$]: 0.01421; Resistance (Ohms): 10K; Tolerance: ±1%; Value: 10k; .Checked SCH: used; Supplier: Digikey; Supplier 1: Digi-Key; Supplier Part Number 1: 311-10.0KLRCT-ND; RoHS: RoHS Compliant; Stock 1: 2916495; Pricing 1: 10=0.014, 50=0.0104, 100=0.0079, 250=0.00584, 500=0.00432, 1000=0.00288 (USD); Composition: Thick Film; Features: -; Size / Dimension: 0.039" L x 0.020" W (1.00mm x 0.50mm); Height: 0.016" (0.40mm); Number of Terminations: 2; Packaging: Cut Tape (CT); ComponentLink1URL: http://www.yageo.com/documents/recent/PYu-RC0402_51_RoHS_L_6.pdf; ComponentLink1Description: http://www.yageo.com/documents/recent/PYu-RC0402_51_RoHS_L_6.pdf
TP42 TP43 = TP_25MILC: Test Point 25mil; .Checked PCB: used

## Sheet [04] - CPU - PCIE, USB.SchDoc
size A2; DocumentNumber: 4; SheetNumber: 4; SheetTotal: 32
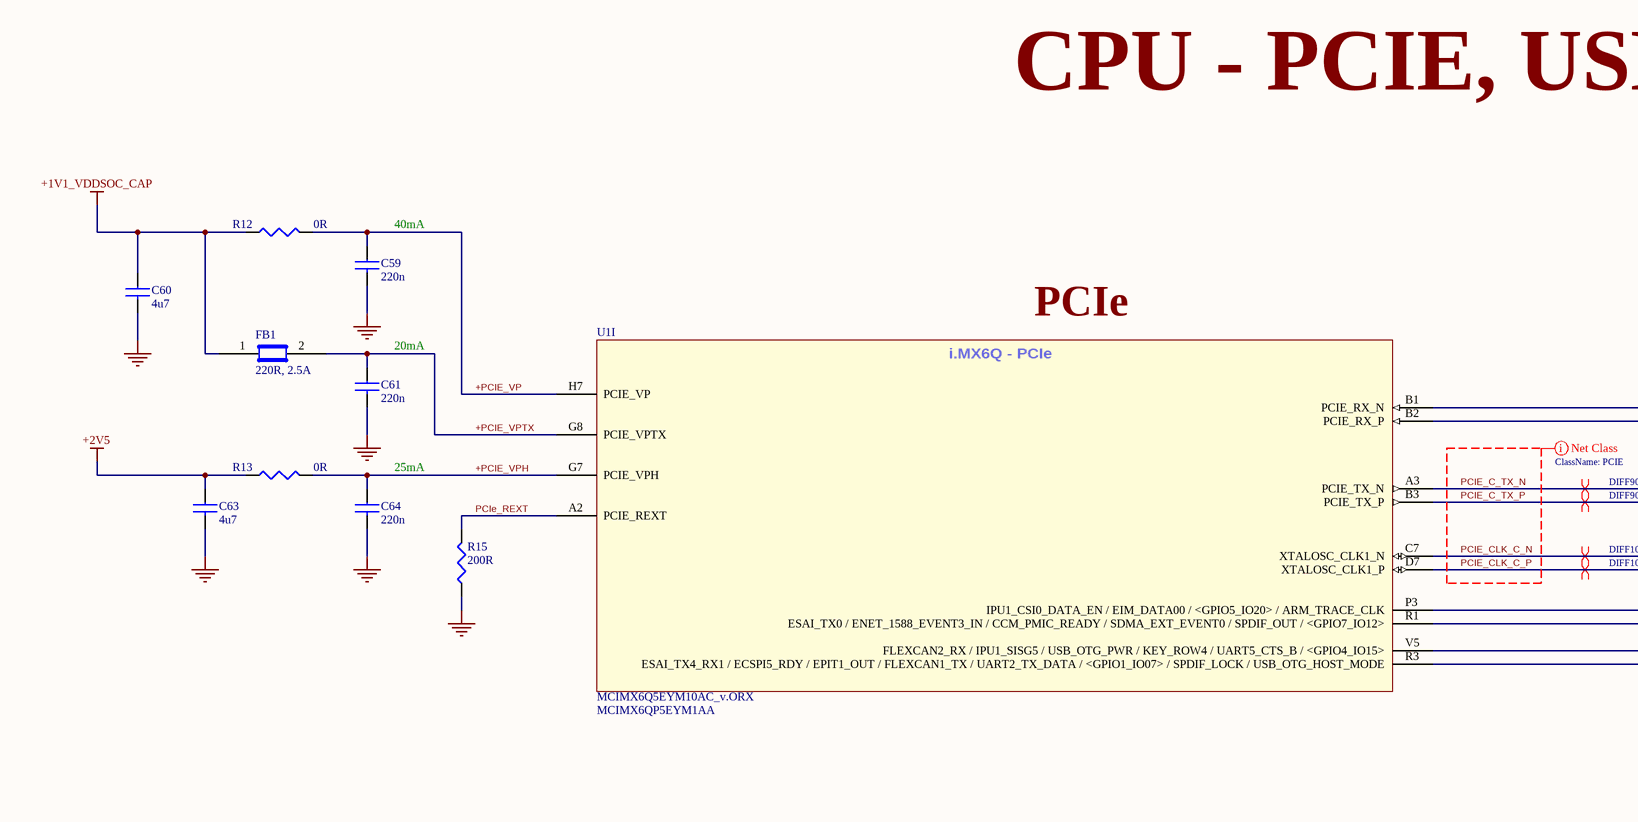
[diagram p8: [04] - CPU - PCIE, USB.SchDoc, top left]
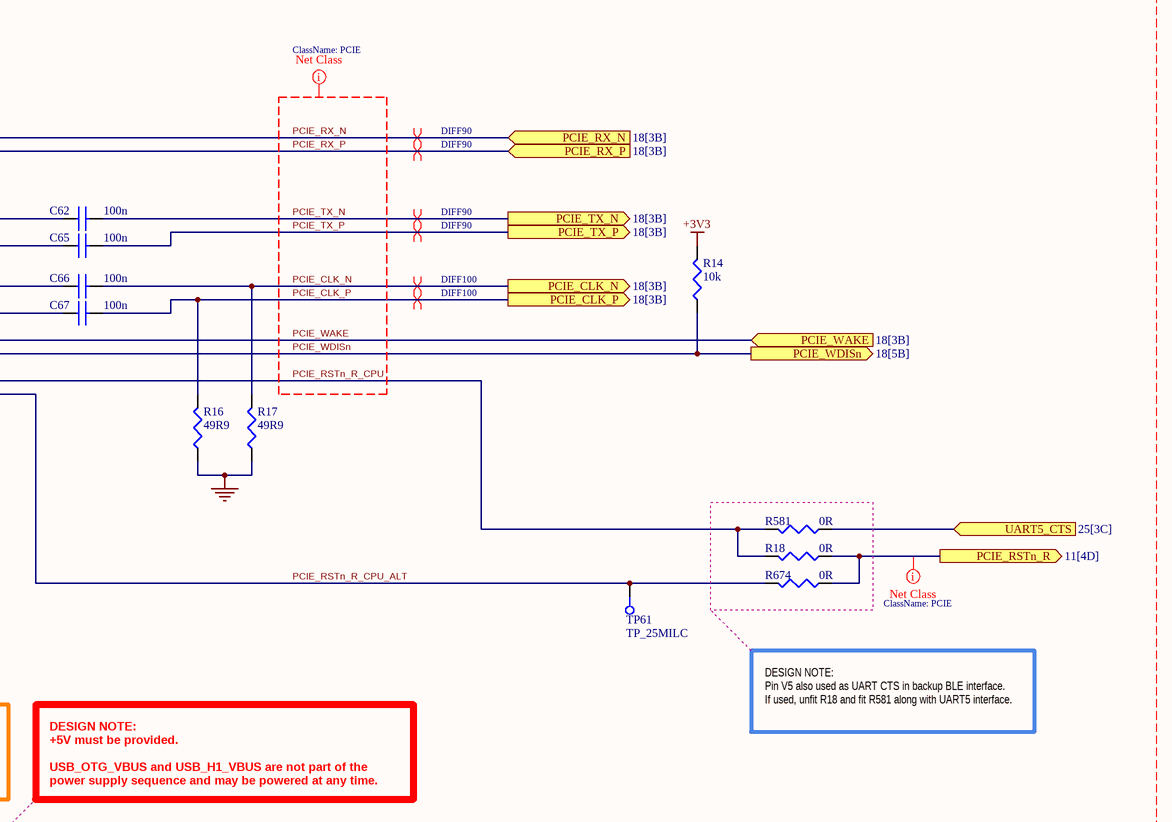
[diagram p9: [04] - CPU - PCIE, USB.SchDoc, top right]
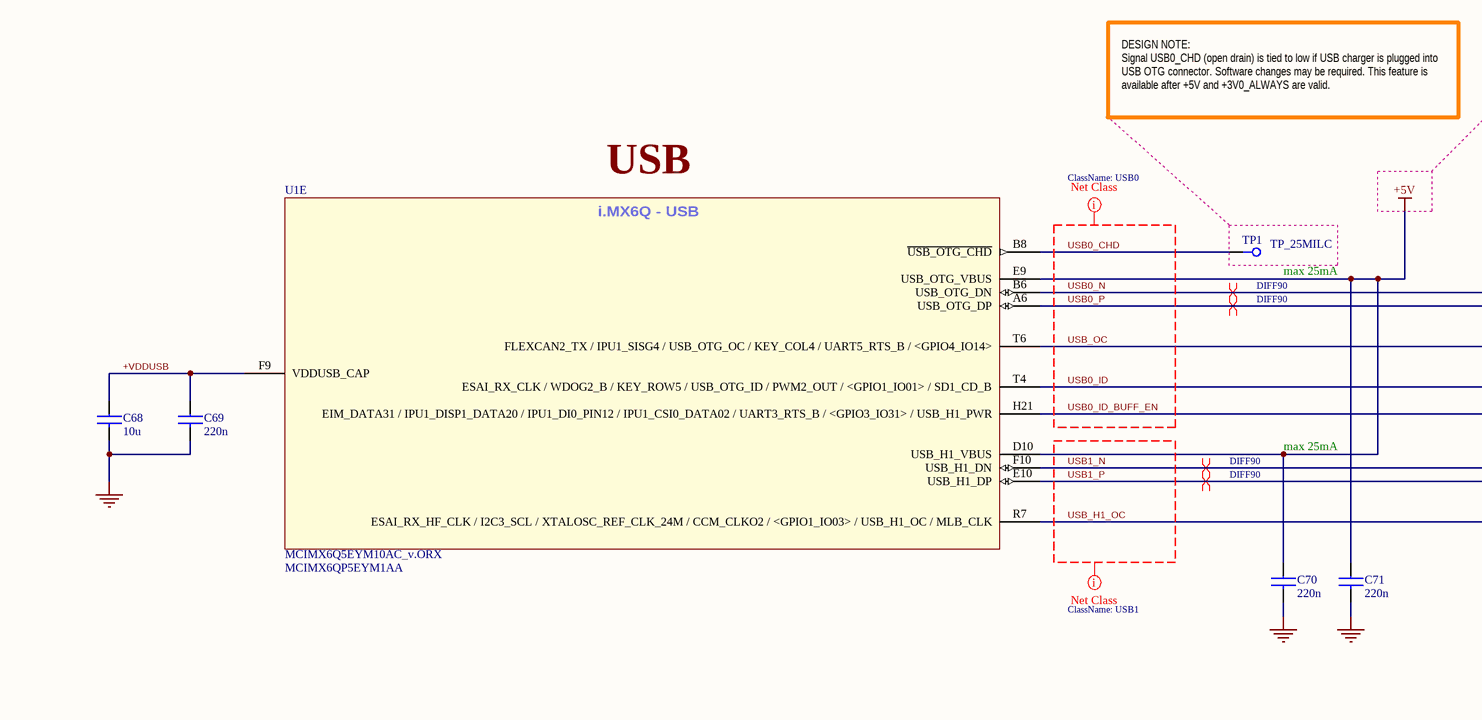
[diagram p10: [04] - CPU - PCIE, USB.SchDoc, bottom left]
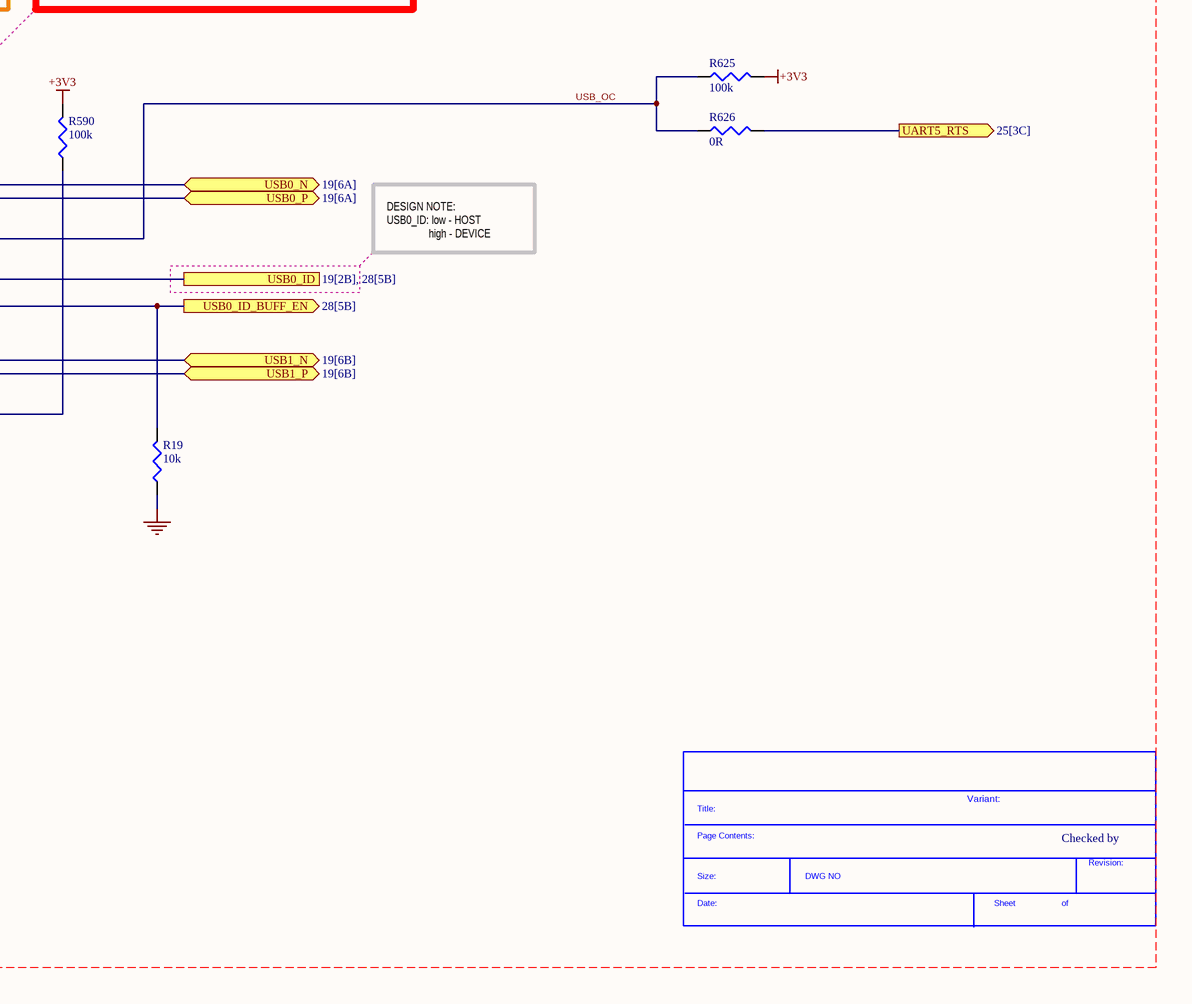
[diagram p11: [04] - CPU - PCIE, USB.SchDoc, bottom right]

### Parts
(Parts that share a designator on the sheet are numbered #1, #2 ... from top to bottom, then left to right.)
*#5  SDTitleBlock  (value not drawn)  (graphical)
C59  220n  [C0201]
C60  4u7  [C0402]
C61  220n  [C0201]
C62  100n  [C0402]
C63  4u7  [C0402]
C64  220n  [C0201]
C65  100n  [C0402]
C66  100n  [C0402]
C67  100n  [C0402]
C68  10u  [C0603]
C69  220n  [C0201]
C70  220n  [C0201]
C71  220n  [C0201]
FB1  220R, 2.5A  [C0603]
R12  0R  [R0402]
R13  0R  [R0402]
R14  10k  [R0402]
R15  200R  [R0402]
R16  49R9  [R0402]
R17  49R9  [R0402]
R18  0R  [R0402]
R19  10k  [R0402]
R581  0R  [R0402]
R590  100k  [R0201]
R625  100k  [R0402]
R626  0R  [R0402]
R674  0R  [R0402]
TP1  TP_25MILC  [TP_25C]  (no BOM)
TP61  TP_25MILC  [TP_25C]  (no BOM)
U1  MCIMX6Q5EYM10AC_v.ORX  Supplier Part Number 2: MCIMX6QP5EYM1AA  [PBGA624]  (parts E,I of 23)

### Ports
PCIE_CLK_N (out, see 18[3B]), PCIE_CLK_P (out, see 18[3B]), PCIE_RSTn_R (out, see 11[4D]), PCIE_RX_N (in, see 18[3B]), PCIE_RX_P (in, see 18[3B]), PCIE_TX_N (out, see 18[3B]), PCIE_TX_P (out, see 18[3B]), PCIE_WAKE (in, see 18[3B]), PCIE_WDISn (out, see 18[5B]), UART5_CTS (in, see 25[3C]), UART5_RTS (out, see 25[3C]), USB0_ID (see 19[2B], 28[5B]), USB0_ID_BUFF_EN (out, see 28[5B]), USB0_N (bidir, see 19[6A]), USB0_P (bidir, see 19[6A]), USB1_N (bidir, see 19[6B]), USB1_P (bidir, see 19[6B])

### Nets
+1V1_VDDSOC_CAP: C60.1 FB1.1 R12.1
+2V5: C63.1 R13.1
+3V3: R14.2 R590.2 R625.2
+5V: C70.1 C71.1 U1.D10(USB_H1_VBUS) U1.E9(USB_OTG_VBUS)
GND: C59.2 C60.2 C61.2 C63.2 C64.2 C68.2 C69.2 C70.2 C71.2 R15.1 R16.1 R17.1 R19.1
+PCIE_VP: C59.1 R12.2 U1.H7(PCIE_VP)
+PCIE_VPH: C64.1 R13.2 U1.G7(PCIE_VPH)
+PCIE_VPTX: C61.1 FB1.2 U1.G8(PCIE_VPTX)
+VDDUSB: C68.1 C69.1 U1.F9(VDDUSB_CAP)
PCIE_C_TX_N: C62.1 U1.A3(PCIE_TX_N)
PCIE_C_TX_P: C65.1 U1.B3(PCIE_TX_P)
PCIE_CLK_C_N: C66.1 U1.C7(XTALOSC_CLK1_N)
PCIE_CLK_C_P: C67.1 U1.D7(XTALOSC_CLK1_P)
PCIE_CLK_N: C66.2 R17.2 ; port PCIE_CLK_N
PCIE_CLK_P: C67.2 R16.2 ; port PCIE_CLK_P
PCIe_REXT: R15.2 U1.A2(PCIE_REXT)
PCIE_RSTn_R: R18.1 R674.1 ; port PCIE_RSTn_R
PCIE_RSTn_R_CPU: R18.2 R581.2 U1.V5(FLEXCAN2_RX_/_IPU1_SISG5_/_USB_OTG_PWR_/_KEY_ROW4_/_UART5_CTS_B_/_<GPIO4_IO15>)
PCIE_RSTn_R_CPU_ALT: R674.2 TP61.1 U1.R3(ESAI_TX4_RX1_/_ECSPI5_RDY_/_EPIT1_OUT_/_FLEXCAN1_TX_/_UART2_TX_DATA_/_<GPIO1_IO07>_/_SPDIF_LOCK_/_USB_OTG_HOST_MODE)
PCIE_RX_N: U1.B1(PCIE_RX_N) ; port PCIE_RX_N
PCIE_RX_P: U1.B2(PCIE_RX_P) ; port PCIE_RX_P
PCIE_TX_N: C62.2 ; port PCIE_TX_N
PCIE_TX_P: C65.2 ; port PCIE_TX_P
PCIE_WAKE: U1.P3(IPU1_CSI0_DATA_EN_/_EIM_DATA00_/_<GPIO5_IO20>_/_ARM_TRACE_CLK) ; port PCIE_WAKE
PCIE_WDISn: R14.1 U1.R1(ESAI_TX0_/_ENET_1588_EVENT3_IN_/_CCM_PMIC_READY_/_SDMA_EXT_EVENT0_/_SPDIF_OUT_/_<GPIO7_IO12>) ; port PCIE_WDISn
UART5_CTS: R581.1 ; port UART5_CTS
UART5_RTS: R626.2 ; port UART5_RTS
USB0_CHD: TP1.1 U1.B8(~{USB_OTG_CHD})
USB0_ID: U1.T4(ESAI_RX_CLK_/_WDOG2_B_/_KEY_ROW5_/_USB_OTG_ID_/_PWM2_OUT_/_<GPIO1_IO01>_/_SD1_CD_B) ; port USB0_ID
USB0_ID_BUFF_EN: R19.2 U1.H21(EIM_DATA31_/_IPU1_DISP1_DATA20_/_IPU1_DI0_PIN12_/_IPU1_CSI0_DATA02_/_UART3_RTS_B_/_<GPIO3_IO31>_/_USB_H1_PWR) ; port USB0_ID_BUFF_EN
USB0_N: U1.B6(USB_OTG_DN) ; port USB0_N
USB0_P: U1.A6(USB_OTG_DP) ; port USB0_P
USB1_N: U1.F10(USB_H1_DN) ; port USB1_N
USB1_P: U1.E10(USB_H1_DP) ; port USB1_P
USB_H1_OC: R590.1 U1.R7(ESAI_RX_HF_CLK_/_I2C3_SCL_/_XTALOSC_REF_CLK_24M_/_CCM_CLKO2_/_<GPIO1_IO03>_/_USB_H1_OC_/_MLB_CLK)
USB_OC: R625.1 R626.1 U1.T6(FLEXCAN2_TX_/_IPU1_SISG4_/_USB_OTG_OC_/_KEY_COL4_/_UART5_RTS_B_/_<GPIO4_IO14>)

### Layout directives
differential pair; net class DIFF100: PCIE_CLK_C_N, PCIE_CLK_C_P, PCIE_CLK_N, PCIE_CLK_P
differential pair; net class DIFF90: PCIE_C_TX_N, PCIE_C_TX_P, PCIE_RX_N, PCIE_RX_P, PCIE_TX_N, PCIE_TX_P, USB0_N, USB0_P, USB1_N, USB1_P
net class PCIE: PCIE_C_TX_N, PCIE_C_TX_P, PCIE_CLK_C_N, PCIE_CLK_C_P, PCIE_CLK_N, PCIE_CLK_P, PCIE_RSTn_R, PCIE_RSTn_R_CPU, PCIE_RX_N, PCIE_RX_P, PCIE_TX_N, PCIE_TX_P, PCIE_WAKE, PCIE_WDISn
net class USB0: USB0_CHD, USB0_ID, USB0_ID_BUFF_EN, USB0_N, USB0_P, USB_OC
net class USB1: USB1_N, USB1_P, USB_H1_OC
net class [04] - CPU - PCIE /USB: +1V1_VDDSOC_CAP, +2V5, +3V3, +5V, +PCIE_VP, +PCIE_VPH, +PCIE_VPTX, +VDDUSB, GND, PCIE_C_TX_N, PCIE_C_TX_P, PCIE_CLK_C_N, PCIE_CLK_C_P, PCIE_CLK_N, PCIE_CLK_P, PCIe_REXT, PCIE_RSTn_R_CPU, PCIE_RSTn_R_CPU_ALT, PCIE_RX_N, PCIE_RX_P, PCIE_TX_N, PCIE_TX_P, PCIE_WAKE, PCIE_WDISn, USB0_CHD, USB0_ID, USB0_ID_BUFF_EN, USB0_N, USB0_P, USB1_N, USB1_P, USB_H1_OC, USB_OC

### Notes on the sheet
- CPU - PCIE, USB
- (near C59) 40mA
- (near C61) 20mA
- PCIe
- (near C64) 25mA
- DESIGN NOTE:
  Pin V5 also used as UART CTS in backup BLE interface.
  If used, unfit R18 and fit R581 along with UART5 interface.
- DESIGN NOTE:
  Signal USB0_CHD (open drain) is tied to low if USB charger is plugged into USB OTG connector. Software changes may be required. This feature is available after +5V and +3V0_ALWAYS are valid.
- DESIGN NOTE:
  +5V must be provided.
  USB_OTG_VBUS and USB_H1_VBUS are not part of the power supply sequence and may be powered at any time.
- USB
- (near TP1) max 25mA
- DESIGN NOTE:
  USB0_ID: low - HOST
  high - DEVICE
- max 25mA
- Variant:
- Checked by
- (in symbol MCIMX6Q5EYM10AC_v.ORX, part E) i.MX6Q - USB
- (in symbol MCIMX6Q5EYM10AC_v.ORX, part I) i.MX6Q - PCIe
- (in symbol SDTitleBlock) Title:; Page Contents:; Revision:; Size:; DWG NO; Date:; Sheet; of

### Library data of the parts
C59 C61 C64 C69-C71 = C0603X5R0J224M030BB: CAP CER 0.22UF 6.3V 20% X5R 0201; Manufacturer: TDK Corporation; Capacitance: 0.22µF; .Checked PCB: used; .Creator: MM; Supplier 1: Digi-Key; Manufacturer Part Number: C0603X5R0J224M030BB; RoHS: RoHS Compliant; Category: Capacitors; Stock 1: 205900; Pricing 1: 1=0.15, 10=0.102, 100=0.0485, 250=0.0408, 500=0.03418, 1000=0.0275, 5000=0.02325 (USD); Packaging: Cut Tape (CT); Tolerance: ±20%; Voltage - Rated: 6.3V; Temperature Coefficient: X5R; Mounting Type: Surface Mount, MLCC; Operating Temperature: -55°C ~ 85°C; Applications: General Purpose; Ratings: -; Package / Case: 0201 (0603 Metric); Size / Dimension: 0.024" L x 0.012" W (0.60mm x 0.30mm); Height - Seated (Max): -; Thickness (Max): 0.013" (0.33mm); Lead Spacing: -; Features: -; Lead Style: -; ComponentLink1URL: http://product.tdk.com/en/catalog/datasheets/mlcc_commercial_general_en.pdf; ComponentLink1Description: http://product.tdk.com/en/catalog/datasheets/mlcc_commercial_general_en.pdf; Supplier Part Number 1: 445-5929-1-ND; .Checked SCH: used; Supplier 2: Digi-Key; Supplier Part Number 2: 1276-1042-6-ND
C60 C63 = C1005X5R1A475M: CAP CER 4.7UF 10V 20% X5R 0402; Manufacturer: TDK Corporation; Capacitance: 4.7µF; .Checked PCB: used; Supplier 1: Digi-Key; Supplier Part Number 1: 445-8023-1-ND; Manufacturer Part Number: C1005X5R1A475M; RoHS: RoHS Compliant; Category: Capacitors; Stock 1: 10140; Pricing 1: 1=0.53, 10=0.415, 100=0.25, 250=0.18752, 500=0.16, 1000=0.125, 5000=0.095 (USD); Voltage - Rated: 10V; Tolerance: ±20%; Temperature Coefficient: X5R; Mounting Type: Surface Mount, MLCC; Operating Temperature: -55°C ~ 85°C; Applications: General Purpose; Ratings: -; Package / Case: 0402 (1005 Metric); Size / Dimension: 0.039" L x 0.020" W (1.00mm x 0.50mm); Height - Seated (Max): -; Thickness (Max): -; Lead Spacing: -; Features: -; Packaging: Cut Tape (CT); Lead Style: -; ComponentLink1URL: http://www.tdk.com/pdf/general_B11.pdf; ComponentLink1Description: http://www.tdk.com/pdf/general_B11.pdf; .Checked SCH: used
C62 C65-C67 = C1005X5R1H104K: as C476 on sheet [17] - LVDS, CSI; Category: Capacitors; Supplier Part Number: 445-5942-1-ND; Manufacturer Part Number: C1005X5R1H104K; Operating Temperature: -55°C ~ 85°C; Package / Case: 0402 (1005 Metric); Price 1k [$]: 0.02340; .Checked SCH: used; Voltage - Rated: 50V; Supplier: Digikey; Supplier 1: Digi-Key; Supplier Part Number 1: 445-5942-1-ND; RoHS: RoHS Compliant; Stock 1: 106926; Pricing 1: 1=0.27, 10=0.18, 100=0.072, 250=0.05176, 500=0.0369, 1000=0.027 (USD); Tolerance: ±10%; Temperature Coefficient: X5R; Mounting Type: Surface Mount, MLCC; Applications: General Purpose; Ratings: -; Size / Dimension: 0.039" L x 0.020" W (1.00mm x 0.50mm); Height - Seated (Max): -; Thickness (Max): 0.022" (0.55mm); Lead Spacing: -; Features: -; Packaging: Cut Tape (CT); Lead Style: -; ComponentLink1URL: http://www.tdk.co.jp/tefe02/e412_c.pdf; ComponentLink1Description: http://www.tdk.co.jp/tefe02/e412_c.pdf; Supplier 2: Digi-Key; Supplier Part Number 2: 311-1697-6-ND
C68 = C1608X5R0J106M: as C475 on sheet [17] - LVDS, CSI; Category: Capacitors; Supplier Part Number: 445-4112-1-ND; Manufacturer Part Number: C1608X5R0J106M; Operating Temperature: -55°C ~ 85°C; Package / Case: 0603 (1608 Metric); Price 1k [$]: 0.08580; .Checked SCH: used; Voltage - Rated: 6.3V; Features: Low ESR; Supplier: Digikey; Supplier 1: Digi-Key; Supplier Part Number 1: 445-4112-1-ND; RoHS: RoHS Compliant; Stock 1: 48157; Pricing 1: 1=0.46, 10=0.363, 100=0.1898, 250=0.14024, 500=0.1089, 1000=0.0858 (USD); Tolerance: ±20%; Temperature Coefficient: X5R; Mounting Type: Surface Mount, MLCC; Applications: General Purpose; Ratings: -; Size / Dimension: 0.063" L x 0.031" W (1.60mm x 0.80mm); Height - Seated (Max): -; Thickness (Max): 0.037" (0.95mm); Lead Spacing: -; Packaging: Cut Tape (CT); Lead Style: -; ComponentLink1URL: http://www.tdk.com/pdf/general_B11.pdf; ComponentLink1Description: http://www.tdk.com/pdf/general_B11.pdf
FB1 = BLM18SG221TN1D: as FB48 on sheet [17] - LVDS, CSI; Supplier 1: Digi-Key; Supplier Part Number 1: 490-5225-1-ND; Manufacturer Part Number: BLM18SG221TN1D; RoHS: RoHS Compliant; Category: Filters; Stock 1: 54640; Pricing 1: 1=0.38, 10=0.282, 50=0.1646, 100=0.1316, 250=0.094, 500=0.06392, 1000=0.0517, 5000=0.04042 (USD); Current Rating: 2.5A; Package / Case: 0603 (1608 Metric); Mounting Type: Surface Mount; Packaging: Cut Tape (CT); Height (Max): 0.037" (0.95mm); Size / Dimension: 0.063" L x 0.031" W (1.60mm x 0.80mm); ComponentLink1URL: http://search.murata.co.jp/Ceramy/image/img/PDF/ENG/L0110S0100BLM18S.pdf; ComponentLink1Description: http://search.murata.co.jp/Ceramy/image/img/PDF/ENG/L0110S0100BLM18S.pdf; .Checked SCH: used
R12 R13 R18 R581 R626 R674 = RC0402JR-070RL: as R443 on sheet [17] - LVDS, CSI; Category: Resistors; Supplier Part Number: 311-0.0JRCT-ND; Manufacturer Part Number: RC0402JR-070RL; Package / Case: 0402 (1005 Metric); Price 1k [$]: 0.01389; Value: 0R; .Checked SCH: used; Supplier: Digikey; Supplier 1: Digi-Key; Supplier Part Number 1: 311-0.0JRCT-ND; RoHS: RoHS Compliant; Stock 1: 1106330; Pricing 1: 10=0.012, 50=0.009, 100=0.0069, 250=0.00512, 500=0.0038, 1000=0.00253 (USD); Composition: Thick Film; Features: -; Temperature Coefficient: -; Size / Dimension: 0.039" L x 0.020" W (1.00mm x 0.50mm); Height: 0.016" (0.40mm); Number of Terminations: 2; Packaging: Cut Tape (CT); ComponentLink1URL: http://www.yageo.com/documents/recent/PYu-RC0402_51_RoHS_L_6.pdf; ComponentLink1Description: http://www.yageo.com/documents/recent/PYu-RC0402_51_RoHS_L_6.pdf
R14 R19 = RC0402FR-0710KL: as R451 on sheet [17] - LVDS, CSI; Category: Resistors; Supplier Part Number: 311-10.0KLRCT-ND; Manufacturer Part Number: RC0402FR-0710KL; Package / Case: 0402 (1005 Metric); Price 1k [$]: 0.01421; Resistance (Ohms): 10K; Tolerance: ±1%; Value: 10k; .Checked SCH: used; Supplier: Digikey; Supplier 1: Digi-Key; Supplier Part Number 1: 311-10.0KLRCT-ND; RoHS: RoHS Compliant; Stock 1: 2916495; Pricing 1: 10=0.014, 50=0.0104, 100=0.0079, 250=0.00584, 500=0.00432, 1000=0.00288 (USD); Composition: Thick Film; Features: -; Size / Dimension: 0.039" L x 0.020" W (1.00mm x 0.50mm); Height: 0.016" (0.40mm); Number of Terminations: 2; Packaging: Cut Tape (CT); ComponentLink1URL: http://www.yageo.com/documents/recent/PYu-RC0402_51_RoHS_L_6.pdf; ComponentLink1Description: http://www.yageo.com/documents/recent/PYu-RC0402_51_RoHS_L_6.pdf
R15 = CRCW0402200RFKED: RES 200 OHM 1/16W 1% 0402 SMD; Manufacturer: Vishay Dale; Resistance (Ohms): 200; Power (Watts): 0.063W, 1/16W; Temperature Coefficient: ±100ppm/°C; .Checked PCB: used; .Creator: MM; Supplier 1: Digi-Key; Manufacturer Part Number: CRCW0402200RFKED; RoHS: RoHS Compliant; Category: Resistors; Stock 1: 251574; Pricing 1: 10=0.083, 50=0.0444, 200=0.0255, 1000=0.0174 (USD); Composition: Thick Film; Features: Automotive AEC-Q200 Qualified; Tolerance: ±1%; Package / Case: 0402 (1005 Metric); Supplier Device Package: 0402 (1005 Metric); Size / Dimension: 0.039" L x 0.020" W (1.00mm x 0.50mm); Height: 0.016" (0.40mm); Number of Terminations: 2; Packaging: Cut Tape (CT); ComponentLink1URL: http://www.vishay.com/doc?20035; ComponentLink1Description: http://www.vishay.com/doc?20035; Supplier Part Number 1: 541-200LCT-ND; .Checked SCH: used
R16 R17 = RC0402FR-0749R9L: RES 49.9 OHM 1/16W 1% 0402 SMD; Manufacturer: Yageo; Resistance (Ohms): 49.9; Power (Watts): 0.063W, 1/16W; Value: 49.9R; .Checked PCB: used; Temperature Coefficient: ±100ppm/°C; Category: Resistors; Supplier Part Number: 311-49.9LRCT-ND; Manufacturer Part Number: RC0402FR-0749R9L; Package / Case: 0402 (1005 Metric); Price 1k [$]: 0.01421; Tolerance: ±1%; .Checked SCH: used; Supplier: Digikey; Supplier 1: Digi-Key; Supplier Part Number 1: 311-49.9LRCT-ND; RoHS: RoHS Compliant; Stock 1: 235950; Pricing 1: 10=0.014, 50=0.0104, 100=0.0079, 250=0.00584, 500=0.00432, 1000=0.00288 (USD); Composition: Thick Film; Features: -; Size / Dimension: 0.039" L x 0.020" W (1.00mm x 0.50mm); Height: 0.016" (0.40mm); Number of Terminations: 2; Packaging: Cut Tape (CT); ComponentLink1URL: http://www.yageo.com/documents/recent/PYu-RC0402_51_RoHS_L_6.pdf; ComponentLink1Description: http://www.yageo.com/documents/recent/PYu-RC0402_51_RoHS_L_6.pdf
R590 = RC0201FR-07100KL: RES 100K OHM 1/20W 1% 0201 SMD; Manufacturer: Yageo; Power (Watts): 0.05W, 1/20W; Temperature Coefficient: ±200ppm/°C; .Creator: MM; .Checked PCB: used; Supplier 1: Digi-Key; Manufacturer Part Number: RC0201FR-07100KL; RoHS: RoHS Compliant; Category: Resistors; Stock 1: 0; Pricing 1: 1=0.1, 10=0.074, 25=0.054, 100=0.0303, 250=0.02312, 500=0.0185, 1000=0.01361, 2500=0.01182, 5000=0.00976 (USD); Packaging: Cut Tape (CT); Resistance (Ohms): 100k; Tolerance: ±1%; Composition: Thick Film; Features: Moisture Resistant; Package / Case: 0201 (0603 Metric); Supplier Device Package: 0201; Size / Dimension: 0.024" L x 0.012" W (0.60mm x 0.30mm); Height: 0.010" (0.26mm); Number of Terminations: 2; ComponentLink1URL: http://www.yageo.com/documents/recent/PYu-RC0201_51_RoHS_L_8.pdf; ComponentLink1Description: http://www.yageo.com/documents/recent/PYu-RC0201_51_RoHS_L_8.pdf; Supplier Part Number 1: 311-100KMCT-ND; .Checked SCH: used; Supplier 2: Digi-Key; Supplier Part Number 2: 1276-3714-1-ND
R625 = RMCF0402FT100K: RES 100K OHM 1/16W 1% 0402 SMD; Manufacturer: Stackpole Electronics Inc; Power (Watts): 0.063W, 1/16W; .Checked PCB: used; Temperature Coefficient: ±100ppm/°C; Category: Resistors; Supplier Part Number: RMCF0402FT100KCT-ND; Manufacturer Part Number: RMCF0402FT100K; Package / Case: 0402 (1005 Metric); Price 1k [$]: 0.00384; Resistance (Ohms): 100K; Tolerance: ±1%; Value: 100k; .Checked SCH: used; Supplier: Digikey; Supplier 1: Digi-Key; Supplier Part Number 1: YAG1343DKR-ND; RoHS: RoHS Compliant; Composition: Thick Film; Features: -; Size / Dimension: 0.039" L x 0.020" W (1.00mm x 0.50mm); Height: 0.016" (0.40mm); Number of Terminations: 2; Packaging: Cut Tape (CT); ComponentLink1URL: http://www.seielect.com/Catalog/SEI-RMCF.pdf; ComponentLink1Description: http://www.seielect.com/Catalog/SEI-RMCF.pdf
TP1 TP61 = TP_25MILC: Test Point 25mil; .Checked PCB: used
U1 = MCIMX6Q5EYM10AC_v.ORX: IC MCU 32BIT ARM QUAD 624FCBGA; Manufacturer: Freescale Semiconductor; Speed: 1.0GHz; .Creator: MM; .Checked PCB: used; Core Processor: ARM® Cortex™-A9; Core Size: 32-Bit Quad-Core; Connectivity: CAN, EBI/EMI, ESAI, Ethernet, GPMI, I2C, MMC/SD, PCI, SATA, SPI, UART, USB, USB OTG; Peripherals: DMA, HDMI, I2S/SSI/AC97, MIPI CSI, MIMI DSI, MIPI HIS, PWM, WDT; Number of I /O: 224; Program Memory Type: External Program Memory; RAM Size: 256K x 8; Voltage - Supply (Vcc/Vdd): 0.925 V ~ 1.5 V; Oscillator Type: Internal; Supplier 1: Digi-Key; Manufacturer Part Number: MCIMX6Q5EYM10AC; RoHS: RoHS Compliant; Category: Integrated Circuits (ICs); Stock 1: 0; Pricing 1: 1=54.98, 10=51.922, 25=48.868, 100=30.5424 (USD); Packaging: Tray; Package / Case: 624-FBGA, FCBGA; ComponentLink1URL: http://cache.freescale.com/files/32bit/doc/data_sheet/IMX6DQCEC.pdf; ComponentLink1Description: Data Sheet; Supplier Part Number 1: MCIMX6Q5EYM10AC-ND; .Checked SCH: used; Program Memory Size: -; EEPROM Size: -; Data Converters: -; Operating Temperature: -20°C ~ 105°C; ComponentLink2Description: User Guide; ComponentLink2URL: file:///C:/Users/mbeach/Downloads/i.MX_Linux_User's_Guide.pdf; Supplier 2: Arrow